# Altium project Hydrophone2012.PrjPCB
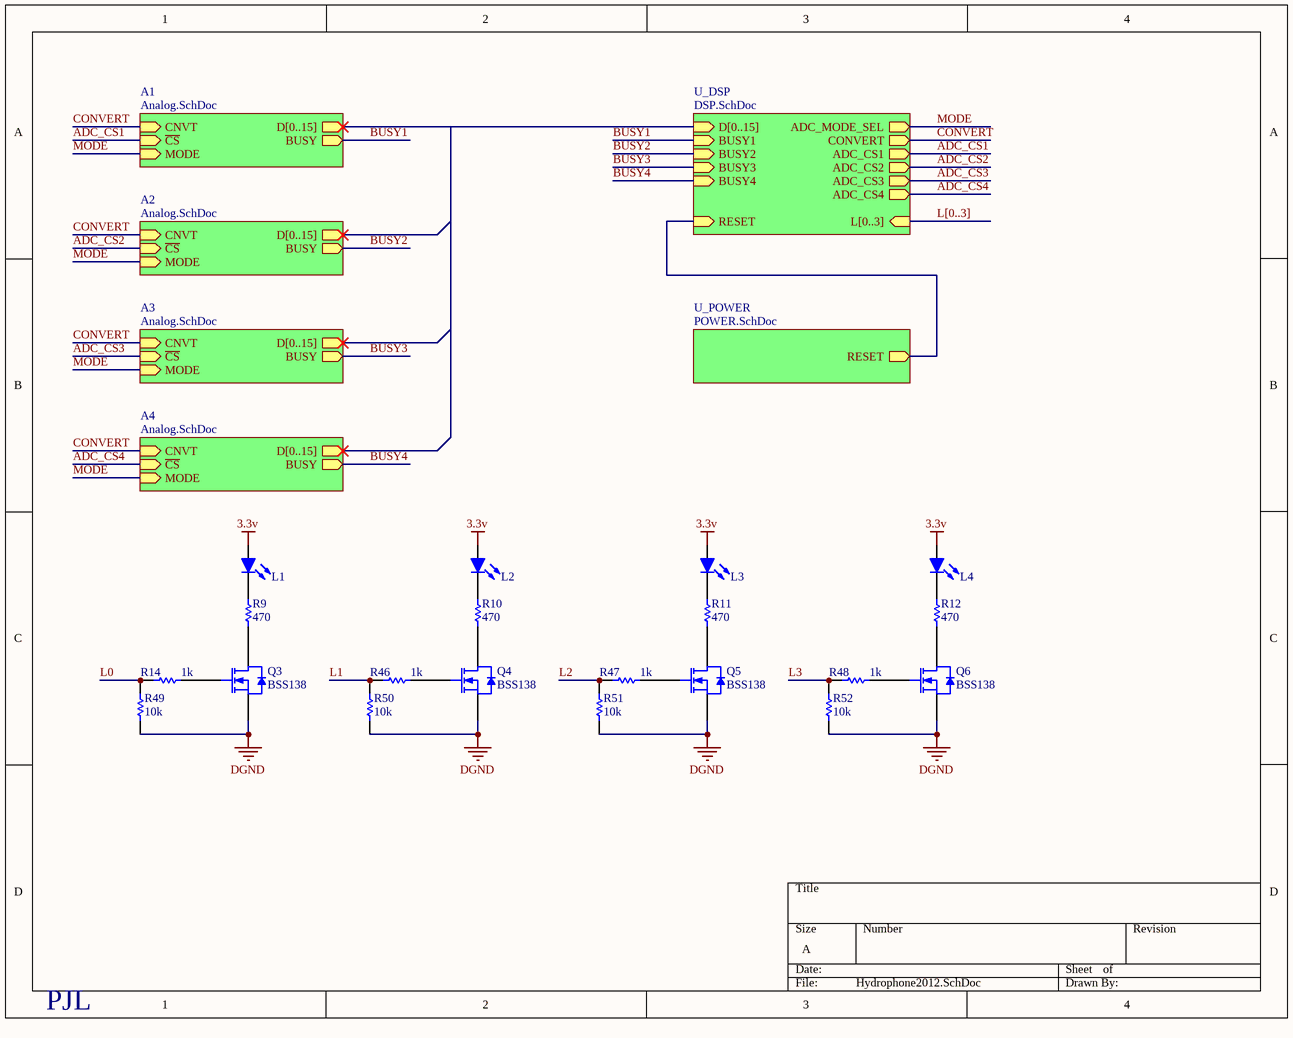
[diagram p0: Hydrophone2012.SchDoc]
5 sheets, 354 parts. Net scope: hierarchical (ports join the sheet entries above them; power ports are global).
Board file: Hydrophone2012.PcbDoc
Sheets:
  Hydrophone2012.SchDoc
    U_POWER = POWER.SchDoc
    A1 = Analog.SchDoc
    A2 = Analog.SchDoc
    A3 = Analog.SchDoc
    A4 = Analog.SchDoc
    U_DSP = DSP.SchDoc
      U_USB = USB.SchDoc

## Sheet Hydrophone2012.SchDoc
size A

### Parts
L1  LED-RED  [LED0805-RED]  (value not drawn)
L2  LED-RED  [LED0805-RED]  (value not drawn)
L3  LED-RED  [LED0805-RED]  (value not drawn)
L4  LED-RED  [LED0805-RED]  (value not drawn)
LOGO1  UF LOGO  [UF LOGO-1000]  (value not drawn)
LOGO2  SubjuGator Logo  [SubjuGator-1200]  (value not drawn)
MIL  MIL LOGO  [MIL LOGO - 600P]  (value not drawn)
Q3  BSS138  [SOT95P237X111-3L]
Q4  BSS138  [SOT95P237X111-3L]
Q5  BSS138  [SOT95P237X111-3L]
Q6  BSS138  [SOT95P237X111-3L]
R9  470  [RESC1608XN]
R10  470  [RESC1608XN]
R11  470  [RESC1608XN]
R12  470  [RESC1608XN]
R14  1k  [RESC1608XL]
R46  1k  [RESC1608XL]
R47  1k  [RESC1608XL]
R48  1k  [RESC1608XL]
R49  10k  [RESC1608XL]
R50  10k  [RESC1608XL]
R51  10k  [RESC1608XL]
R52  10k  [RESC1608XL]

### Sub-sheets
A1 = Analog.SchDoc: D[0..15] (out, harness Harness), CNVT (in), BUSY (out), ~{CS} (in), MODE (in)
A2 = Analog.SchDoc: D[0..15] (out), CNVT (in), BUSY (out), ~{CS} (in), MODE (in)
A3 = Analog.SchDoc: D[0..15] (out), CNVT (in), BUSY (out), ~{CS} (in), MODE (in)
A4 = Analog.SchDoc: D[0..15] (out), CNVT (in), BUSY (out), ~{CS} (in), MODE (in)
U_DSP = DSP.SchDoc: ADC_MODE_SEL (out), D[0..15] (in), CONVERT (out), ADC_CS1 (out), ADC_CS2 (out), ADC_CS3 (out), ADC_CS4 (out), BUSY1 (in), BUSY2 (in), BUSY3 (in), BUSY4 (in), RESET (in), L[0..3] (in)
U_POWER = POWER.SchDoc: RESET (out)

### Nets
3.3v: L1.2(A) L2.2(A) L3.2(A) L4.2(A)
DGND: Q3.2(S) Q4.2(S) Q5.2(S) Q6.2(S) R49.2 R50.2 R51.2 R52.2
ADC_CS1: sheet A1/~{CS}, sheet U_DSP/ADC_CS1
ADC_CS2: sheet A2/~{CS}, sheet U_DSP/ADC_CS2
ADC_CS3: sheet A3/~{CS}, sheet U_DSP/ADC_CS3
ADC_CS4: sheet A4/~{CS}, sheet U_DSP/ADC_CS4
BUSY1: sheet A1/BUSY, sheet U_DSP/BUSY1
BUSY2: sheet A2/BUSY, sheet U_DSP/BUSY2
BUSY3: sheet A3/BUSY, sheet U_DSP/BUSY3
BUSY4: sheet A4/BUSY, sheet U_DSP/BUSY4
CONVERT: sheet A1/CNVT, sheet A2/CNVT, sheet A3/CNVT, sheet A4/CNVT, sheet U_DSP/CONVERT
L0: R14.1 R49.1
L1: R46.1 R50.1
L2: R47.1 R51.1
L3: R48.1 R52.1
MODE: sheet A1/MODE, sheet A2/MODE, sheet A3/MODE, sheet A4/MODE, sheet U_DSP/ADC_MODE_SEL
NetL1_1: L1.1(K) R9.2
NetL2_1: L2.1(K) R10.2
NetL3_1: L3.1(K) R11.2
NetL4_1: L4.1(K) R12.2
NetNC1_1: sheet U_POWER/RESET, sheet U_DSP/RESET
NetQ3_1: Q3.1(G) R14.2
NetQ3_3: Q3.3(D) R9.1
NetQ4_1: Q4.1(G) R46.2
NetQ4_3: Q4.3(D) R10.1
NetQ5_1: Q5.1(G) R47.2
NetQ5_3: Q5.3(D) R11.1
NetQ6_1: Q6.1(G) R48.2
NetQ6_3: Q6.3(D) R12.1

### Buses and harness runs
bus L[0..3] = sheet U_DSP/L[0..3]
bus sheet A2/D[0..15] = sheet A3/D[0..15] = sheet A4/D[0..15] = sheet U_DSP/D[0..15]

### Notes on the sheet
- (near LOGO1) PJL

### Library data of the parts
L1-L4 = LED-RED: Light Emitting Diode - RED; Manufacturer Part Number: LTST-C170CKT; Manufacturer: Lite-On Inc; Millicandela Rating: 10mcd; Viewing Angle: 130°; Voltage - Forward (Vf) Typ: 1.8V; Current - Test: 10mA; Package / Case: 0805 (2012 Metric); Color: Red; Supplier Part Number: 160-1176-2-ND; Supplier: Digi-Key
Q3-Q6 = BSS138: 200ma N-Channel Mosfet; Manufacturer Part Number: BSS138LT1G; Manufacturer: ON Semiconductor; Supplier Part Number: BSS138LT1GOSCT-ND; Supplier: Digi-Key; Package / Case: TO-236-3, SC-59, SOT-23-3
R9-R12 = RES-CHIP: RES 470 OHM .25W 5% 0603 SMD; Manufacturer: Vishay Dale; Manufacturer Part Number: CRCW0603470RJNEAHP; Power (Watts): 0.25W, 1/4W; Supplier Part Number: 541-470SACT-ND; Supplier: Digi-Key; Resistance (Ohms): 470; Package / Case: 0603 (1608 Metric); Tolerance: ±5%
R14 R46-R48 = RES-CHIP: Resistor Chip; Manufacturer: Yageo; Manufacturer Part Number: RC0603JR-071KL; Tolerance: ±5%; Power (Watts): 0.1W, 1/10W; Supplier Part Number: 311-1.0KGRCT-ND; Supplier: Digi-Key; Package / Case: 0603 (1608 Metric); Resistance (Ohms): 1k
R49-R52 = RES-CHIP: Resistor Chip; Manufacturer: Yageo; Manufacturer Part Number: RC0603JR-0710KL; Tolerance: ±5%; Power (Watts): 0.1W, 1/10W; Supplier Part Number: 311-10KGRCT-ND; Supplier: Digi-Key; Package / Case: 0603 (1608 Metric); Resistance (Ohms): 10k

## Sheet POWER.SchDoc
size B
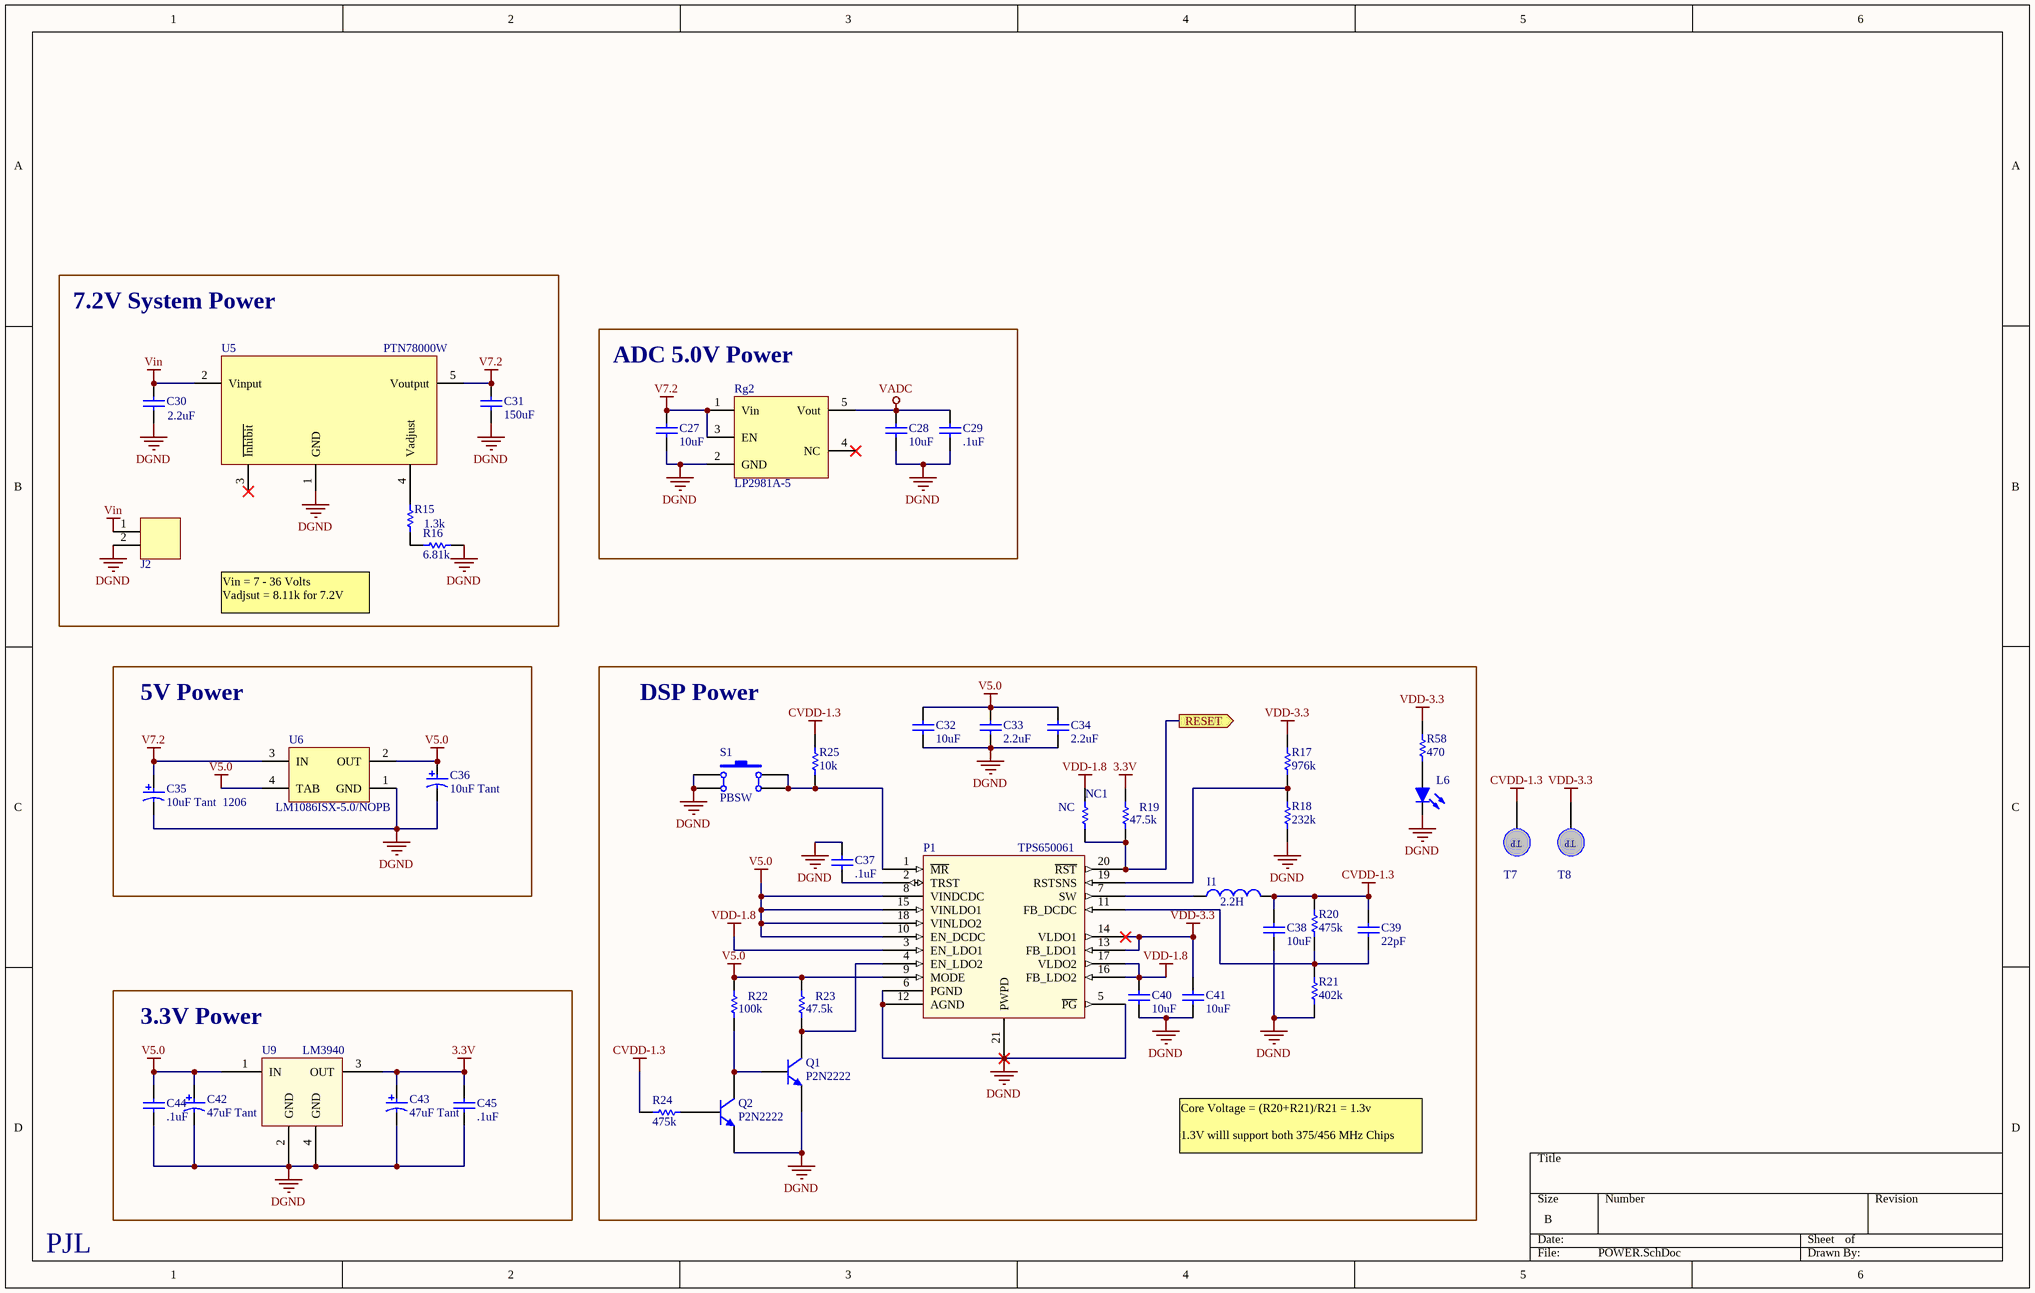
[diagram p1: POWER.SchDoc]

### Parts
C27  10uF  [CAPC2012XL]
C28  10uF  [CAPC2012XL]
C29  .1uF  [CAPC1608XN]
C30  2.2uF  [CAPC2012XL]
C31  150uF  [CAPPR2.5-6.3x11]
C32  10uF  [CAPC2012XL]
C33  2.2uF  [CAPC1608XN]
C34  2.2uF  [CAPC1608XN]
C35  10uF Tant  1206  [CAPMP3216XN]
C36  10uF Tant  [CAPMP2012XL]
C37  .1uF  [CAPC1608XN]
C38  10uF  [CAPC2012XL]
C39  22pF  [CAPC1608XN]
C40  10uF  [CAPC2012XL]
C41  10uF  [CAPC2012XL]
C42  47uF Tant  [CAPMP2012XL]
C43  47uF Tant  [CAPMP2012XL]
C44  .1uF  [CAPC1608XN]
C45  .1uF  [CAPC1608XN]
I1  2.2H  [LPS3015]
J2  2-pin Horz Sherlock  [MOLEX-HDR-1X2-SHERLOCK-HORZ]  (value not drawn)
L6  LED-GREEN  [LED0805-GREEN]  (value not drawn)
NC1  NC  [RESC1608XN]
P1  TPS650061  [QFN4-20N]
Q1  P2N2222  [TO-92A]
Q2  P2N2222  [TO-92A]
R15  1.3k  [RESC1608XL]
R16  6.81k  [RESC1608XL]
R17  976k  [RESC1608XL]
R18  232k  [RESC1608XL]
R19  47.5k  [RESC1608XN]
R20  475k  [RESC1608XL]
R21  402k  [RESC1608XL]
R22  100k  [RESC1608XL]
R23  47.5k  [RESC1608XN]
R24  475k  [RESC1608XL]
R25  10k  [RESC1608XL]
R58  470  [RESC1608XN]
Rg2  LP2981A-5  [TI-SOT-23_5N]
S1  PBSW  [PBSW]
T7  TEST MINI  [TEST-POINT - 5015]  (value not drawn)
T8  TEST MINI  [TEST-POINT - 5015]  (value not drawn)
U5  PTN78000W  [TI-EUS - 3d]
U6  LM1086ISX-5.0/NOPB  [TO263]
U9  LM3940  [SOT230P700X155-4N]

### Blocks framed on the sheet
7.2V System Power: C30 C31 J2 R15 R16 U5
ADC 5.0V Power: C27-C29 Rg2
5V Power: C35 C36 U6
DSP Power: C32-C34 C37-C41 I1 L6 NC1 P1 Q1 Q2 R17-R25 R58 S1
3.3V Power: C42-C45 U9

### Ports
RESET (out)

### Nets
3.3v: C43.1 C45.2 R19.2 U9.3(OUT)
CVDD-1.3: C38.2 C39.2 I1.2 R20.2 R24.2 R25.2 T7.1
DGND: C27.1 C28.1 C29.1 C30.1 C31.2 C32.1 C33.1 C34.1 C35.2 C36.2 C37.2 C38.1 C40.1 C41.1 C42.2 C43.2 C44.1 C45.1 J2.2 L6.1(K) P1.5(~{PG}) P1.6(PGND) P1.12(AGND) P1.21(PWPD) Q1.3(E) Q2.3(E) R16.1 R18.2 R21.2 Rg2.2(GND) S1.1(A) S1.2(A') U5.1(GND) U6.1(GND) U9.2(GND) U9.4(GND)
V5.0: C32.2 C33.2 C34.2 C36.1 C42.1 C44.2 P1.8(VINDCDC) P1.9(MODE) P1.10(EN_DCDC) P1.15(VINLDO1) P1.18(VINLDO2) R22.2 R23.2 U6.2(OUT) U6.4(TAB) U9.1(IN)
V7.2: C27.2 C31.1 C35.1 Rg2.1(Vin) Rg2.3(EN) U5.5(Voutput) U6.3(IN)
VADC: C28.2 C29.2 Rg2.5(Vout)
VDD-1.8: C40.2 NC1.2 P1.3(EN_LDO1) P1.16(FB_LDO2) P1.17(VLDO2)
VDD-3.3: C41.2 P1.13(FB_LDO1) P1.14(VLDO1) R17.1 R58.2 T8.1
Vin: C30.2 J2.1 U5.2(Vinput)
NetC37_1: C37.1 P1.2(TRST)
NetC39_1: C39.1 P1.11(FB_DCDC) R20.1 R21.1
NetI1_1: I1.1 P1.7(SW)
NetL6_2: L6.2(A) R58.1
NetNC1_1: NC1.1 P1.20(~{RST}) R19.1 ; port RESET
NetP1_1: P1.1(~{MR}) R25.1 S1.3(B) S1.4(B')
NetP1_4: P1.4(EN_LDO2) Q1.1(C) R23.1
NetP1_19: P1.19(RSTSNS) R17.2 R18.1
NetQ1_2: Q1.2(B) Q2.1(C) R22.1
NetQ2_2: Q2.2(B) R24.1
NetR15_1: R15.1 U5.4(Vadjust)
NetR15_2: R15.2 R16.2

Not connected (* = marked no-connect by the designer): Rg2 4(NC)*; U5 3(~{Inhibit})*

### Notes on the sheet
- Vin = 7 - 36 Volts
  Vadjsut = 8.11k for 7.2V
- Core Voltage = (R20+R21)/R21 = 1.3v
  1.3V willl support both 375/456 MHz Chips
- PJL
- (in symbol TEST-POINT) TP

### Library data of the parts
C27 C28 C32 C38 C40 C41 = CAP-CERAMIC-NP: CAP CER 10UF 10V 10% X7R 0805; Manufacturer: Murata Electronics North America; Manufacturer Part Number: GRM21BR71A106KE51L; Capacitance: 10µF; Tolerance: ±10%; Operating Temperature: -55°C ~ 125°C; Supplier Part Number: 490-3905-1-ND; Supplier: Digi-Key; Voltage - Rated: 10V; Package / Case: 0805 (2012 Metric)
C29 C44 C45 = CAP-CERAMIC-NP: CAP CER 0.1UF 10V 20% X7R 0603; Manufacturer Part Number: CX0603MRX7R6BB104; Manufacturer: Yageo; Capacitance: 0.1µF; Applications: Bypass, Decoupling; Operating Temperature: -55°C ~ 125°C; Tolerance: ±20%; Package / Case: 0603 (1608 Metric); Voltage - Rated: 10V; Temperature Coefficient: X7R; Supplier Part Number: 311-1237-1-ND; Supplier: Digi-Key
C30 = Capacitor: Non Polarized Capacitor 2.2uF; Manufacturer: TDK Corporation; Manufacturer Part Number: C2012X5R1H225K; Value: 2.2uF; Supplier: DigiKey; Supplier Part Number: 445-5976-1-ND
C31 = Capacitor: CAP ALUM 150UF 25V 20% RADIAL; Manufacturer: Panasonic Electronic Components; Manufacturer Part Number: EEU-FR1E151; Capacitance: 150µF; Supplier Part Number: P14414-ND; Supplier: Digi-Key; Tolerance: ±20%; Package / Case: Radial, Can; Lead Spacing: 0.098" (2.50mm); Height - Seated (Max): 0.441" (11.20mm); Size / Dimension: 0.248" Dia (6.30mm); Voltage Rating: 25V
C33 C34 = CAP-CERAMIC-NP: CAP CER 2.2UF 10V 10% X5R 0603; Manufacturer: Murata Electronics North America; Manufacturer Part Number: GRM188R61A225KE34D; Capacitance: 2.2µF; Tolerance: ±10%; Package / Case: 0603 (1608 Metric); Voltage - Rated: 10V; Temperature Coefficient: X5R; Supplier: Digi-Key; Supplier Part Number: 490-1545-1-ND
C35 = CAP-TANT: Capacitor, Tantalum, Polarized; Manufacturer: Vishay Sprague; Manufacturer Size Code: A; Manufacturer Part Number: 293D106X9016A2TE3; ESR (Equivalent Series Resistance): 3 Ohm; Tolerance: ±10%; Capacitance: 10µF; Voltage - Rated: 16V; Description: CAP TANT 10UF 16V 10% 1206; Supplier: Digi-Key; Supplier Part Number: 718-1123-2-ND; Package / Case: 1206 (3216 Metric)
C36 = CAP-TANT: Capacitor, Tantalum, Polarized; Manufacturer: AVX Corporation; Manufacturer Part Number: TAJP106M010RNJ; Voltage - Rated: 10V; Capacitance: 10µF; Tolerance: ±20%; Description: CAP TANT 10UF 10V 20% 0805; Supplier: Digi-Key; Package / Case: 0805 (2012 Metric); Supplier Part Number: 478-3281-1-ND
C37 = CAP-CERAMIC-NP: CAP CER 0.1UF 16V 10% X7R 0603; Manufacturer Part Number: GRM188R71C104KA01D; Manufacturer: Murata Electronics North America; Capacitance: 0.1µF; Tolerance: ±10%; Package / Case: 0603 (1608 Metric); Supplier Part Number: 490-1532-1-ND; Supplier: Digi-Key; Voltage - Rated: 16V
C39 = CAP-CERAMIC-NP: CAP CER 22PF 50V 5% NP0 0603; Manufacturer: Murata Electronics North America; Manufacturer Part Number: GRM1885C1H220JA01D; Package / Case: 0603 (1608 Metric); Capacitance: 22pF; Tolerance: ±5%; Voltage - Rated: 50V; Supplier Part Number: 490-1411-1-ND; Supplier: Digi-Key
C42 C43 = CAP-TANT: Capacitor, Tantalum, Polarized; Manufacturer Part Number: TLJR476M010R3200; Manufacturer: AVX Corporation; Description: CAP TANT 47UF 10V 20% 0805; Voltage - Rated: 10V; Tolerance: ±20%; Capacitance: 47µF; Supplier: Digi-Key; Supplier Part Number: 478-5990-1-ND; Package / Case: 0805 (2012 Metric); Features: General Purpose
I1 = VLC5045: Manufacturer: Coilcraft; Manufacturer Part Number: LPS3015-222ML
J2 = MOLEX-HDR-1x2-SHERLOCK_RA: Header, Molex, 2mm Pitch Sherlock Header, Single Row, Horizontal, 2 Circuits, Length 3.3mm,  0353630260; Manufacturer: Molex Inc; Manufacturer Part Number: 0353630260; Supplier Part Number: WM18931-ND; Supplier: Digi-Key
L6 = LED-GREEN: Light Emitting Diode - GREEN; Manufacturer Part Number: LTST-C171GKT; Manufacturer: Lite-On Inc; Description: LED GREEN CLEAR THIN 0805 SMD; Viewing Angle: 130°; Millicandela Rating: 12mcd; Current - Test: 20mA; Voltage - Forward (Vf) Typ: 2.1V; Supplier Part Number: 160-1423-1-ND; Supplier: Digi-Key; Package / Case: 0805 (2012 Metric); Color: Green
NC1 = RES-CHIP: Resistor Chip
P1 = TPS650061: IC CONV STP-DWN 2.25MHZ DL 20QFN; Manufacturer: Texas Instruments; Manufacturer Part Number: TPS650061RUKT; Voltage - Supply: 2.3 V ~ 6 V; Operating Temperature: -40°C ~ 85°C; Package / Case: 20-WFQFN Exposed Pad; Supplier: Digi-Key; Supplier Part Number: 296-25358-1-ND
Q1 Q2 = P2N2222: TRANS GP SS NPN LP 40V TO92; Manufacturer Part Number: P2N2222AG; Manufacturer: ON Semiconductor; Transistor Type: NPN; Voltage - Collector Emitter Breakdown (Max): 40V; Supplier: Digi-Key; Package / Case: TO-226-3, TO-92-3 (TO-226AA); Supplier Part Number: P2N2222AGOS-ND
R15 = Resistor: 1.3k Ohm Resistor; Manufacturer Part Number: RT0603DRD071K3L; Manufacturer: Yageo; Tolerance: ±0.5%; Power (Watts): 0.1W, 1/10W; Description: RES 1.3K OHM 1/10W .5% 0603 SMD; Resistance (Ohms): 1.3k; Supplier Part Number: 311-1.3KDCT-ND; Package / Case: 0603 (1608 Metric); Supplier: Digi-Key
R16 = Resistor: Resistor 6.81k; Manufacturer: Yageo; Manufacturer Part Number: RT0603DRD076K81L; Power (Watts): 0.1W, 1/10W; Tolerance: ±0.5%; Description: RES 6.81K OHM 1/10W .5% 0603 SMD; Supplier Part Number: 311-6.81KDCT-ND; Resistance (Ohms): 6.81k; Supplier: Digi-Key; Package / Case: 0603 (1608 Metric)
R17 = RES-CHIP: Resistor Chip; Manufacturer Part Number: RC0603FR-07976KL; Manufacturer: Yageo; Power (Watts): 0.1W, 1/10W; Tolerance: ±1%; Description: RES 976K OHM 1/10W 1% 0603 SMD; Resistance (Ohms): 976k; Package / Case: 0603 (1608 Metric); Supplier Part Number: 311-976KHRCT-ND; Supplier: Digi-Key
R18 = RES-CHIP: Resistor Chip; Manufacturer Part Number: CRCW0603232KFKEA; Manufacturer: Vishay Dale; Tolerance: ±1%; Power (Watts): 0.1W, 1/10W; Description: RES 232K OHM 1/10W 1% 0603 SMD; Package / Case: 0603 (1608 Metric); Resistance (Ohms): 232k; Supplier Part Number: 541-232KHTR-ND; Supplier: Digi-Key
R19 R23 = RES-CHIP: Resistor Chip; Manufacturer: TE Connectivity; Manufacturer Part Number: 2-1879338-5; Description: RES 47.5K OHM 1/16W 1% 0603; Tolerance: ±1%; Power (Watts): 0.063W, 1/16W; Supplier Part Number: A102279CT-ND; Supplier: Digi-Key; Package / Case: 0603 (1608 Metric); Resistance (Ohms): 47.5k
R20 R24 = RES-CHIP: Resistor Chip; Manufacturer: Yageo; Manufacturer Part Number: RC0603FR-07475KL; Tolerance: ±1%; Power (Watts): 0.1W, 1/10W; Description: RES 475K OHM 1/10W 1% 0603 SMD; Package / Case: 0603 (1608 Metric); Resistance (Ohms): 475k; Supplier: Digi-Key; Supplier Part Number: 311-475KHRTR-ND
R21 = RES-CHIP: RES 402K OHM 1/10W 1% 0603 SMD; Manufacturer: Yageo; Manufacturer Part Number: RC0603FR-07402KL; Power (Watts): 0.1W, 1/10W; Supplier: Digi-Key; Package / Case: 0603 (1608 Metric); Tolerance: ±1%; Resistance (Ohms): 402k; Supplier Part Number: 311-402KHRCT-ND
R22 = RES-CHIP: RES 100K OHM 1/10W 1% 0603 SMD; Manufacturer Part Number: RC0603FR-07100KL; Manufacturer: Yageo; Power (Watts): 0.1W, 1/10W; Supplier Part Number: 311-100KHRTR-ND; Supplier: Digi-Key; Resistance (Ohms): 100k; Tolerance: ±1%; Package / Case: 0603 (1608 Metric)
R25 = RES-CHIP: Resistor Chip; Manufacturer: Yageo; Manufacturer Part Number: RC0603JR-0710KL; Description: RES 10K OHM 1/10W 5% 0603 SMD; Tolerance: ±5%; Power (Watts): 0.1W, 1/10W; Supplier Part Number: 311-10KGRCT-ND; Supplier: Digi-Key; Package / Case: 0603 (1608 Metric); Resistance (Ohms): 10k
R58 = RES-CHIP: as R9 on sheet Hydrophone2012; Supplier Part Number: 541-470SACT-ND; Supplier: Digi-Key; Resistance (Ohms): 470; Package / Case: 0603 (1608 Metric); Tolerance: ±5%
Rg2 = LP2981A: 100mA 5v LDO - 0.75% accuracy; Manufacturer: Texas Instruments; Manufacturer Part Number: LP2981A-50DBVT; Description: IC REG LDO 5V .1A SOT23-5; Voltage - Input: Up to 16V; Current - Output: 100mA (Max); Voltage - Dropout (Typical): 0.2V @ 100mA; Supplier Part Number: 296-32146-1-ND; Supplier: Digi-Key; Operating Temperature: -40°C ~ 125°C; Supplier Device Package: SOT-23-5; Voltage - Output: 5V
S1 = SW-PB: Push Button Switch; Manufacturer: Panasonic Electronic Components; Manufacturer Part Number: EVQ-9P105M; Description: SWITCH TACTILE SPST-NO 0.05A 12V; Outline: 6.10mm x 6.00mm; Actuator Orientation: Top Actuated; Actuator Height off PCB, from Pins: 5.00mm; Published: 24-Mar-1999; LatestRevisionDate: 17-Jul-2002; LatestRevisionNote: Re-released for DXP Platform.; PackageReference: SPST-2; Publisher: Altium Limited; PackageDescription: Switch; 2 Leads; Supplier: Digi-Key; Supplier Part Number: P13586SCT-ND
T7 T8 = TEST-POINT: PC TEST POINT MINIATURE SMT; Manufacturer: Keystone Electronics; Manufacturer Part Number: 5015; Supplier: Digi-Key; Supplier Part Number: 5015KDKR-ND
U5 = PTN78000W: 1.5A, 7-36V Input, Variable Switching Voltage Regulator; Manufacturer Part Number: PTN78000WAH; Order Part Number: 296-20506-ND; Manufacturer: Texas Instruments; Description: REG SW 2.5-12.6V 1.5A HORZ T/H; Voltage - Input (Max): 36V; Voltage - Input (Min): 7V; Voltage - Output 1: 2.5 ~ 12.6 V; Efficiency: 91%; Supplier: Digi-Key; Current - Output (Max): 1.5A; Supplier Part Number: 296-20506-ND
U6 = LM1086ISX-5.0/NOPB: 1.5A Low Dropout Positive Regulators, 3-pin TO-263, Pb-Free; Manufacturer: National Semiconductor; Voltage - Dropout (Typical): 1.3V @ 1.5A; Voltage - Input: Up to 25V; Voltage - Output: 5V; Description: IC REG LDO 5V 1.5A TO-263; Manufacturer Part Number: LM1086ISX-5.0/NOPB; Current - Output: 1.5A; Supplier: Digi-Key; Package / Case: TO-263-4, D²Pak (3 Leads + Tab), TO-263AA; Supplier Device Package: TO-263-3; Supplier Part Number: LM1086IS-5.0-ND
U9 = LM3940: 3.3V Regulator from a 5V Supply; Manufacturer: National Semiconductor; Manufacturer Part Number: LM3940IMP-3.3/NOPB; Current - Output: 1A; Description: IC REG LDO 3.3V 1A SOT-223; Voltage - Input: Up to 7.5V; Voltage - Dropout (Typical): 0.5V @ 1A; Package / Case: TO-261-4, TO-261AA; Supplier Part Number: LM3940IMP-3.3CT-ND; Voltage - Output: 3.3V; Supplier: Digi-Key

## Sheet Analog.SchDoc
size B
Used 4 times, as channels A1, A2, A3, A4. Parts and nets are listed once, with the designators drawn on the sheet.
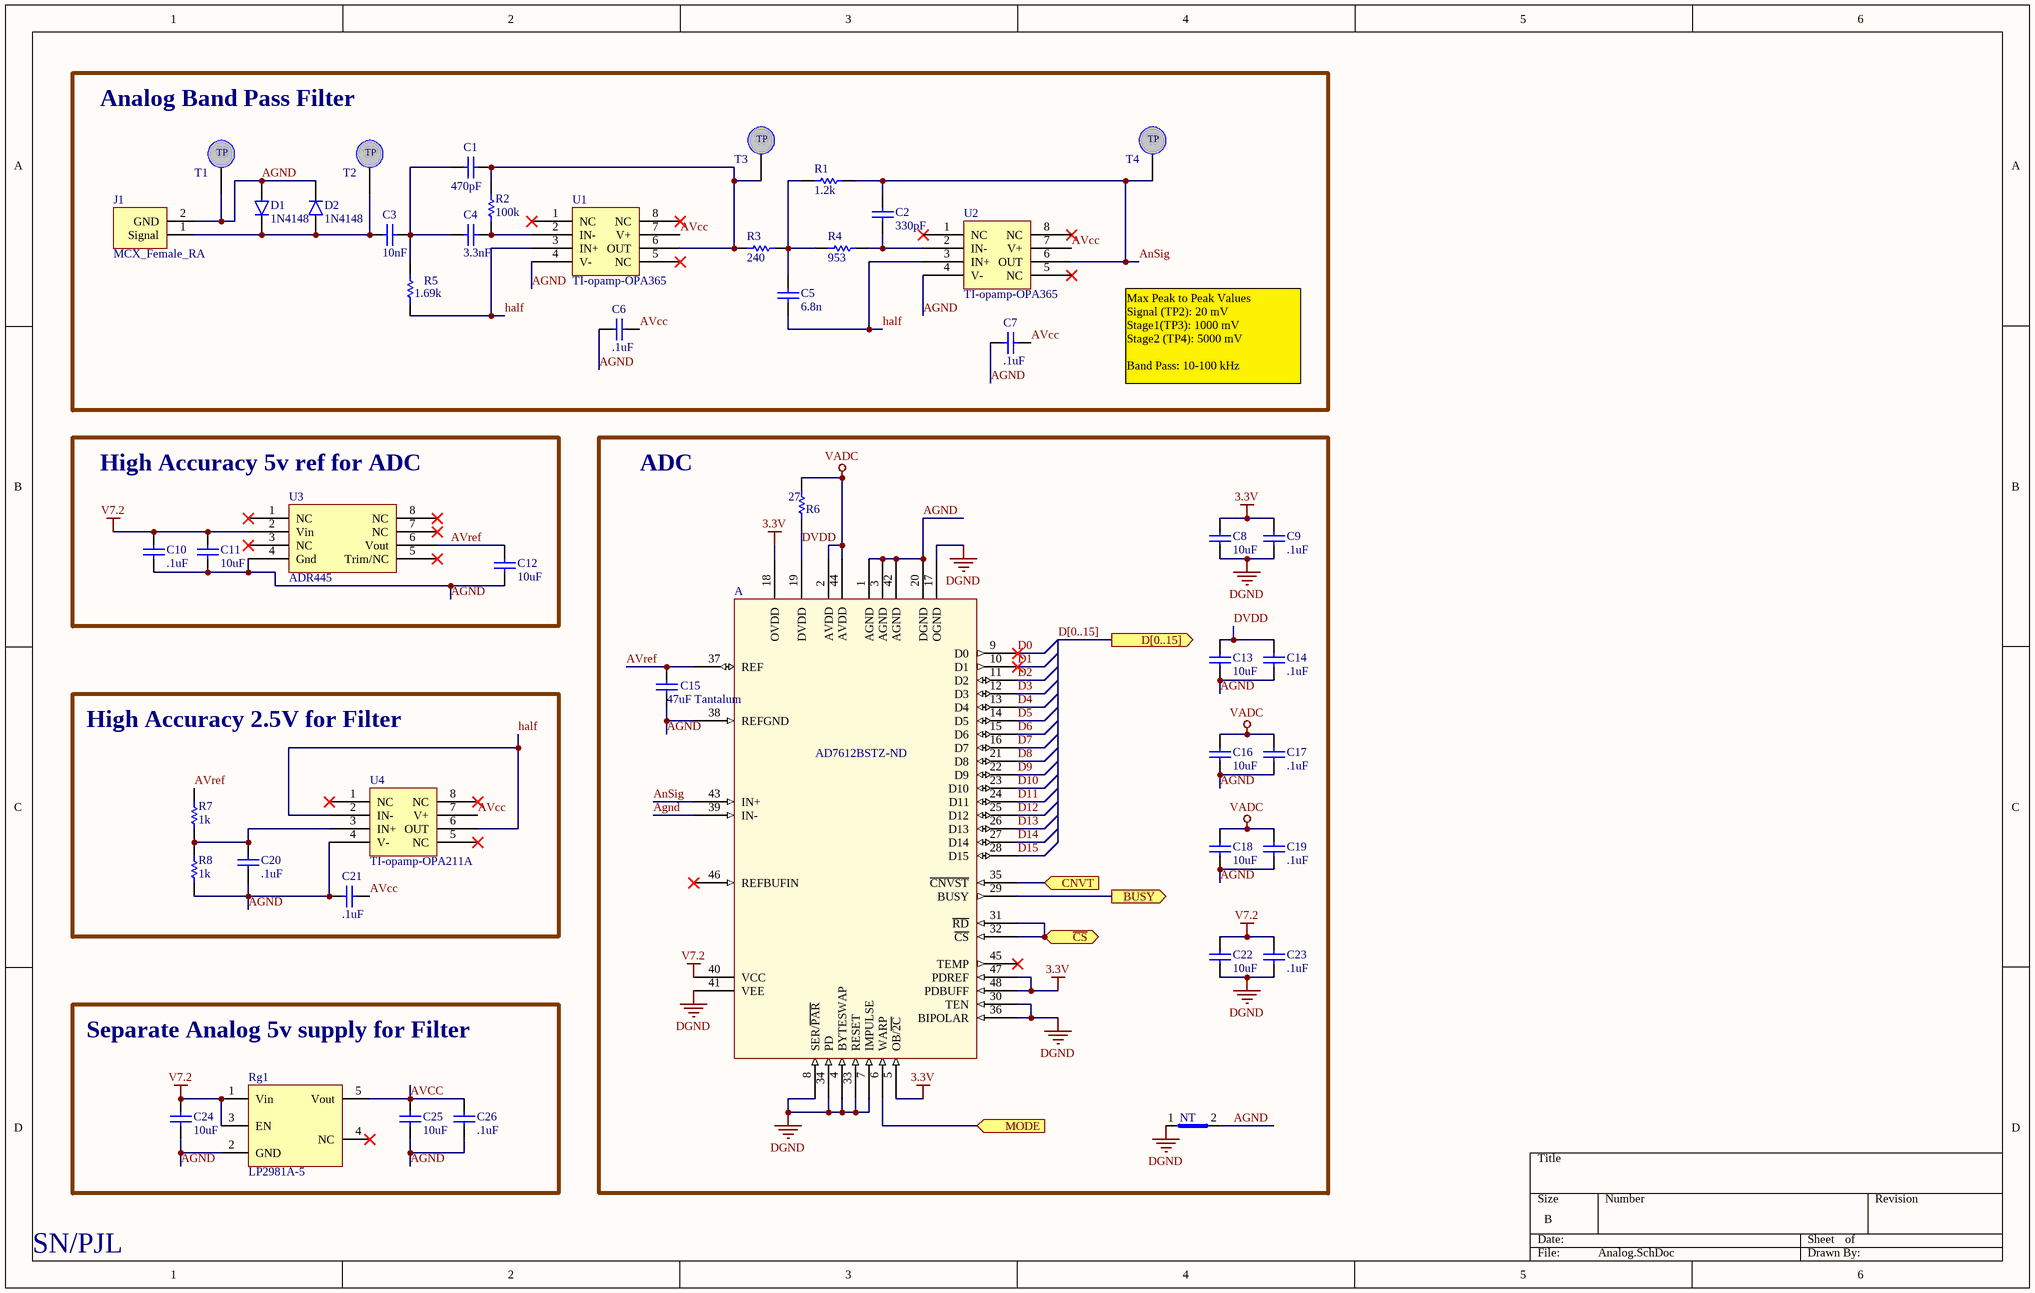
[diagram p2: Analog.SchDoc]

### Parts
A  Supplier Part Number: AD7612BSTZ-ND  [LQFP-48N - ADC]  (hidden comment: AD7612)
C1  470pF  [CAPC2012XN]
C2  330pF  [CAPC2012XN]
C3  10nF  [CAPC2012XN]
C4  3.3nF  [CAPC2012XN]
C5  6.8n  [CAPC2012XN]
C6  .1uF  [CAPC1608XN]
C7  .1uF  [CAPC1608XN]
C8  10uF  [CAPC2012XL]
C9  .1uF  [CAPC1608XN]
C10  .1uF  [CAPC1608XN]
C11  10uF  [CAPC2012XL]
C12  10uF  [CAPC2012XL]
C13  10uF  [CAPC2012XL]
C14  .1uF  [CAPC1608XN]
C15  47uF Tantalum  [CAPC2012XL]
C16  10uF  [CAPC2012XL]
C17  .1uF  [CAPC1608XN]
C18  10uF  [CAPC2012XL]
C19  .1uF  [CAPC1608XN]
C20  .1uF  [CAPC1608XN]
C21  .1uF  [CAPC1608XN]
C22  10uF  [CAPC2012XL]
C23  .1uF  [CAPC1608XN]
C24  10uF  [CAPC2012XL]
C25  10uF  [CAPC2012XL]
C26  .1uF  [CAPC1608XN]
D1  1N4148  [MCC-SOD123]
D2  1N4148  [MCC-SOD123]
J1  MCX_Female_RA  [MCX_Female]
NT  Net Tie SMT  [NetTie 35 mil]  (value not drawn)  (net tie, no BOM)
R1  1.2k  [RESC2012XN]
R2  100k  [RESC2012XN]
R3  240  [RESC2012XN]
R4  953  [RESC2012XN]
R5  1.69k  [RESC2012XN]
R6  27  [RESC2012XN]
R7  1k  [RESC2012XN]
R8  1k  [RESC2012XN]
Rg1  LP2981A-5  [TI-SOT-23_5N]
T1  TEST  [KEYSTONE-TEST-POINT]  (value not drawn)
T2  TEST  [KEYSTONE-TEST-POINT]  (value not drawn)
T3  TEST  [KEYSTONE-TEST-POINT]  (value not drawn)
T4  TEST  [KEYSTONE-TEST-POINT]  (value not drawn)
U1  TI-opamp-OPA365  [TI-SOIC1-8N]
U2  TI-opamp-OPA365  [TI-SOIC1-8N]
U3  ADR445  [TI-SOIC1-8N]
U4  TI-opamp-OPA211A  [TI-SOIC1-8N]

### Blocks framed on the sheet
Analog Band Pass Filter: C1-C7 D1 D2 J1 R1-R5 T1-T4 U1 U2
High Accuracy 5v ref for ADC: C10-C12 U3
ADC: A C8 C9 C13-C19 C22 C23 NT R6
High Accuracy 2.5V for Filter: C20 C21 R7 R8 U4
Separate Analog 5v supply for Filter: C24-C26 Rg1

### Ports
BUSY (out), CNVT (in), D[0..15] (out), MODE (in), ~{CS} (in)

### Nets
3.3V: A.5(OB/~{2C}) A.18(OVDD) A.47(PDREF) A.48(PDBUFF) C8.2 C9.2
DGND: A.4(BYTESWAP) A.7(IMPULSE) A.8(SER/~{PAR}) A.17(OGND) A.30(TEN) A.33(RESET) A.34(PD) A.36(BIPOLAR) A.41(VEE) C8.1 C9.1 C22.1 C23.1 NT.1(Net1)
V7.2: A.40(VCC) C10.1 C11.2 C22.2 C23.2 C24.2 Rg1.1(Vin) Rg1.3(EN) U3.2(Vin)
VADC: A.2(AVDD) A.44(AVDD) C16.2 C17.2 C18.2 C19.2 R6.2
Agnd: A.1(AGND) A.3(AGND) A.20(DGND) A.38(REFGND) A.39(IN-) A.42(AGND) C6.2 C7.1 C10.2 C11.1 C12.1 C13.1 C14.1 C15.1 C16.1 C17.1 C18.1 C19.1 C20.1 C21.2 C24.1 C25.1 C26.1 D1.1(Anode) D2.2(Cathode) J1.2(GND) NT.2(Net2) R8.2 Rg1.2(GND) T1.1 U1.4(V-) U2.4(V-) U3.4(Gnd) U4.4(V-)
AnSig: A.43(IN+) C2.1 R1.1 T4.1 U2.6(OUT)
AVcc: C6.1 C7.2 C21.1 C25.2 C26.2 Rg1.5(Vout) U1.7(V+) U2.7(V+) U4.7(V+)
AVref: A.37(REF) C12.2 C15.2 R7.1 U3.6(Vout)
BUSY: A.29(BUSY) ; port BUSY
~{CS}: A.31(~{RD}) A.32(~{CS}) ; port ~{CS}
CNVT: A.35(~{CNVST}) ; port CNVT
D0: A.9(D0)
D1: A.10(D1)
D2: A.11(D2)
D3: A.12(D3)
D4: A.13(D4)
D5: A.14(D5)
D6: A.15(D6)
D7: A.16(D7)
D8: A.21(D8)
D9: A.22(D9)
D10: A.23(D10)
D11: A.24(D11)
D12: A.25(D12)
D13: A.26(D13)
D14: A.27(D14)
D15: A.28(D15)
DVDD: A.19(DVDD) C13.2 C14.2 R6.1
half: C5.2 R5.1 U1.3(IN+) U2.3(IN+) U4.2(IN-) U4.6(OUT)
MODE: A.6(WARP) ; port MODE
NetC1_1: C1.1 C3.2 C4.1 R5.2
NetC1_2: C1.2 R2.1 R3.2 T3.1 U1.6(OUT)
NetC2_2: C2.2 R4.1 U2.2(IN-)
NetC3_1: C3.1 D1.2(Cathode) D2.1(Anode) J1.1(Signal) T2.1
NetC4_2: C4.2 R2.2 U1.2(IN-)
NetC5_1: C5.1 R1.2 R3.1 R4.2
NetC20_2: C20.2 R7.2 R8.1 U4.3(IN+)

Not connected (* = marked no-connect by the designer): A 45(TEMP)* 46(REFBUFIN)*; Rg1 4(NC)*; U1 1(NC)* 5(NC)* 8(NC)*; U2 1(NC)* 5(NC)* 8(NC)*; U3 1(NC)* 3(NC)* 5(Trim/NC)* 7(NC)* 8(NC)*; U4 1(NC)* 5(NC)* 8(NC)*

### Channels
A1: designators end in _A1; ports BUSY=BUSY1 CNVT=CONVERT MODE=MODE ~{CS}=ADC_CS1
A2: designators end in _A2; ports BUSY=BUSY2 CNVT=CONVERT MODE=MODE ~{CS}=ADC_CS2
A3: designators end in _A3; ports BUSY=BUSY3 CNVT=CONVERT MODE=MODE ~{CS}=ADC_CS3
A4: designators end in _A4; ports BUSY=BUSY4 CNVT=CONVERT MODE=MODE ~{CS}=ADC_CS4

### Buses and harness runs
bus D[0..15] = port D[0..15]

### Notes on the sheet
- Max Peak to Peak Values
  Signal (TP2): 20 mV
  Stage1(TP3): 1000 mV
  Stage2 (TP4): 5000 mV
  Band Pass: 10-100 kHz
- SN/PJL
- (in symbol TEST-POINT) TP

### Library data of the parts
A = AD7623: Manufacturer Part Number: AD7612BSTZ; Manufacturer: Analog Devices Inc; Data Interface: Serial, Parallel; Sampling Rate (Per Second): 750k; Number of Bits: 16; Description: IC ADC 16BIT 750KSPS SAR 48-LQFP; Package / Case: 48-LQFP; Supplier: Digi-Key
C1 = CAP-CERAMIC-NP: Capacitor, Ceramic, Chip, Non-Polarized; Manufacturer Part Number: 08051A471FAT2A; Manufacturer: AVX Corporation; Voltage - Rated: 100V; Tolerance: ±1%; Description: CAP CER 470PF 100V 1% NP0 0805; Capacitance: 470pF; Package / Case: 0805 (2012 Metric); Supplier Part Number: 478-5272-1-ND; Supplier: Digi-Key
C2 = CAP-CERAMIC-NP: Capacitor, Ceramic, Chip, Non-Polarized; Manufacturer: AVX Corporation; Manufacturer Part Number: 08055A331FAT2A; Description: CAP CER 330PF 50V 1% NP0 0805; Voltage - Rated: 50V; Tolerance: ±1%; Supplier: Digi-Key; Supplier Part Number: 478-6045-1-ND; Thickness (Max): 0.037" (0.94mm); Capacitance: 330pF; Package / Case: 0805 (2012 Metric)
C3 = CAP-CERAMIC-NP: Capacitor, Ceramic, Chip, Non-Polarized; Manufacturer Part Number: GRM2195C1H103JA01D; Manufacturer: Murata Electronics North America; Tolerance: ±5%; Voltage Rating: ? V; Capacitance: 10000pF; Voltage - Rated: 50V; Description: CAP CER 10000PF 50V 5% NP0 0805; Supplier: Digi-Key; Supplier Part Number: 490-1642-1-ND; Package / Case: 0805 (2012 Metric)
C4 = CAP-CERAMIC-NP: Capacitor, Ceramic, Chip, Non-Polarized; Manufacturer: Murata Electronics North America; Manufacturer Part Number: GRM2165C1H332JA01D; Voltage - Rated: 50V; Capacitance: 3300pF; Tolerance: ±5%; Description: CAP CER 3300PF 50V 5% NP0 0805; Package / Case: 0805 (2012 Metric); Supplier Part Number: 490-1632-1-ND; Supplier: Digi-Key
C5 = CAP-CERAMIC-NP: CAP CER 6800PF 50V 5% NP0 0805; Manufacturer: Murata Electronics North America; Manufacturer Part Number: GRM2195C1H682JA01D; Supplier: Digi-Key; Supplier Part Number: 490-1638-1-ND; Voltage - Rated: 50V; Capacitance: 6800pF; Tolerance: ±5%; Package / Case: 0805 (2012 Metric)
C6 C7 C9 C10 C14 C17 C19-C21 C23 C26 = CAP-CERAMIC-NP: as C29 on sheet POWER; Applications: Bypass, Decoupling; Operating Temperature: -55°C ~ 125°C; Tolerance: ±20%; Package / Case: 0603 (1608 Metric); Voltage - Rated: 10V; Temperature Coefficient: X7R; Supplier Part Number: 311-1237-1-ND; Supplier: Digi-Key
C8 C11-C13 C16 C18 C22 C24 C25 = CAP-CERAMIC-NP: as C27 on sheet POWER; Tolerance: ±10%; Operating Temperature: -55°C ~ 125°C; Supplier Part Number: 490-3905-1-ND; Supplier: Digi-Key; Voltage - Rated: 10V; Package / Case: 0805 (2012 Metric)
C15 = CAP-CERAMIC-NP: CAP TANT 47UF 10V 20% 0805; Manufacturer Part Number: TLJR476M010R3200; Manufacturer: AVX Corporation; ESR (Equivalent Series Resistance): 3.2 Ohm; Capacitance: 47µF; Package / Case: 0805 (2012 Metric); Supplier: Digi-Key; Supplier Part Number: 478-5990-1-ND; Tolerance: ±20%
D1 D2 = Diode - 1N4148W: DIODE SWITCH SS 75V 150MA SOD123; Manufacturer Part Number: 1N4148W-V-GS08; Manufacturer: Vishay Semiconductors; Speed: Small Signal =< 200mA (Io), Any Speed; Voltage - Forward (Vf) (Max) @ If: 1.2V @ 100mA; Diode Type: Standard; Supplier: Digi-Key; Package / Case: SOD-123; Supplier Device Package: SOD-123; Supplier Part Number: 1N4148W-V-GS08CT-ND; Current - Average Rectified (Io): 150mA; Voltage - DC Reverse (Vr) (Max): 75V
J1 = MCX_Female_RA: MCX female receptacle RA; Manufacturer Part Number: 1061023-1; Manufacturer: TE Connectivity; Frequency - Max: 6GHz; Impedance: 50 Ohm; Description: CONN JACK RCPT R/A 50 OHM NICKEL; Fastening Type: Snap-On; Mounting Type: Through Hole, Right Angle; Supplier Part Number: A98546-ND; Connector Style: MCX; Supplier: Digi-Key
NT = NetTie: Net-Tie, Surface Mount
R1 = RES-CHIP: RES 1.2K OHM .1% 1/4W 0805 SMD; Manufacturer Part Number: RG2012P-122-B-T5; Manufacturer: Susumu; Description: RES 1.2K OHM 1/8W .1% 0805 SMD; Power (Watts): 0.125W, 1/8W; Tolerance: ±0.1%; Supplier Part Number: RG20P1.2KBCT-ND; Resistance (Ohms): 1.2k; Supplier: Digi-Key; Package / Case: 0805 (2012 Metric)
R2 = RES-CHIP: RES PREC 100K OHM 250MW .1% 0805; Manufacturer Part Number: PFC-W0805LF-03-1003-B-1739; Manufacturer: TT Electronics/IRC; Temperature Coefficient: ±25ppm/°C; Tolerance: ±0.1%; Supplier Part Number: 989-1134-1-ND; Supplier: Digi-Key; Resistance (Ohms): 100k; Package / Case: 0805 (2012 Metric)
R3 = RES-CHIP: Resistor Chip; Manufacturer: Susumu; Manufacturer Part Number: RG2012P-241-B-T5; Tolerance: ±0.1%; Power (Watts): 0.125W, 1/8W; Description: RES 240 OHM 1/8W .1% 0805 SMD; Resistance (Ohms): 240; Package / Case: 0805 (2012 Metric); Supplier Part Number: RG20P240BCT-ND; Supplier: Digi-Key
R4 = RES-CHIP: Resistor Chip; Manufacturer: Panasonic Electronic Components; Manufacturer Part Number: ERA-6AEB9530V; Tolerance: ±0.1%; Description: RES 953 OHM 1/8W .1% 0805 SMD; Power (Watts): 0.125W, 1/8W; Supplier Part Number: P953DACT-ND; Resistance (Ohms): 953; Supplier: Digi-Key; Package / Case: 0805 (2012 Metric)
R5 = RES-CHIP: RES 1.69K OHM 1/8W .1% 0805 SMD; Manufacturer: Susumu; Manufacturer Part Number: RG2012P-1691-B-T5; Tolerance: ±0.1%; Power (Watts): 0.125W, 1/8W; Package / Case: 0805 (2012 Metric); Resistance (Ohms): 1.69k; Supplier Part Number: RG20P1.69KBCT-ND; Supplier: Digi-Key
R6 = Resistor: Manufacturer Part Number: ESR10EZPJ270; Manufacturer: Rohm Semiconductor; Power (Watts): 0.25W, 1/4W; Tolerance: ±5%; Description: RES 27 OHM 1/4W 5% 0805 SMD; Package / Case: 0805 (2012 Metric); Supplier Part Number: RHM27KCT-ND; Resistance (Ohms): 27; Supplier: Digi-Key
R7 R8 = RES-CHIP: Resistor Chip; Manufacturer: Susumu; Manufacturer Part Number: RGH2012-2E-P-102-B; Description: RES 1.0K OHM .1% 1/4W 0805 SMD; Power (Watts): 0.25W, 1/4W; Tolerance: ±0.1%; Supplier: Digi-Key; Supplier Part Number: RGH20P1.0KBCT-ND; Resistance (Ohms): 1k; Package / Case: 0805 (2012 Metric)
Rg1 = LP2981A: as Rg2 on sheet POWER; Supplier Part Number: 296-32146-1-ND; Supplier: Digi-Key; Operating Temperature: -40°C ~ 125°C; Supplier Device Package: SOT-23-5; Voltage - Output: 5V
T1 = TEST-POINT: Single pin, looped test point --- 0.063" (1.600mm) Hole Diameter; Manufacturer: Keystone Electronics; Manufacturer Part Number: 5006; Color: Black; Description: TEST POINT PC COMPACT .063"D BLK; Supplier Part Number: 5006K-ND; Supplier: Digi-Key
T2-T4 = TEST-POINT: Single pin, looped test point --- 0.063" (1.600mm) Hole Diameter; Manufacturer Part Number: 5006; Manufacturer: Keystone Electronics; Color: Black; Description: TEST POINT PC COMPACT .063"D BLK; Mounting Type: 0.063" (1.60mm) Hole Diameter; Supplier: Digi-Key; Supplier Part Number: 5006K-ND
U1 U2 = TI-opamp-OPA365: Manufacturer Part Number: OPA365AID; Manufacturer: Texas Instruments; Voltage - Supply, Single/Dual (±): 2.2 V ~ 5.5 V, ±1.1 V ~ 2.25 V; Current - Output / Channel: 65mA; Amplifier Type: General Purpose; Voltage - Input Offset: 100µV; Number of Circuits: 1; Gain Bandwidth Product: 50MHz; Output Type: Rail-to-Rail; Description: IC OPAMP GP R-R 50MHZ SGL 8SOIC; Supplier Part Number: 296-21235-5-ND; Supplier: Digi-Key; Package / Case: 8-SOIC (0.154", 3.90mm Width)
U3 = ADR445: Ultralow Noise, LDO XFET Voltage   References with Current Sink and Source; Manufacturer Part Number: ADR445BRZ; Manufacturer: Analog Devices Inc; Description: IC VREF SERIES PREC 5V 8-SOIC; Voltage - Output: 5V; Voltage - Input: 5.5 V ~ 18 V; Current - Output: 10mA; Tolerance: ±0.04%; Supplier Device Package: 8-SOIC N; Package / Case: 8-SOIC (0.154", 3.90mm Width); Supplier: Digi-Key; Supplier Part Number: ADR445BRZ-ND
U4 = TI-opamp-OPA211A: IC OPAMP GP R-R 80MHZ SGL 8SOIC; Manufacturer Part Number: OPA211AIDR; Manufacturer: Texas Instruments; Voltage - Supply, Single/Dual (±): 4.5 V ~ 36 V, ±2.25 V ~ 18 V; Output Type: Rail-to-Rail; Current - Output / Channel: 30mA; Supplier: Digi-Key; Supplier Device Package: 8-SOIC; Package / Case: 8-SOIC (0.154", 3.90mm Width); Supplier Part Number: 296-22634-1-ND; Gain Bandwidth Product: 80MHz

## Sheet DSP.SchDoc
size D
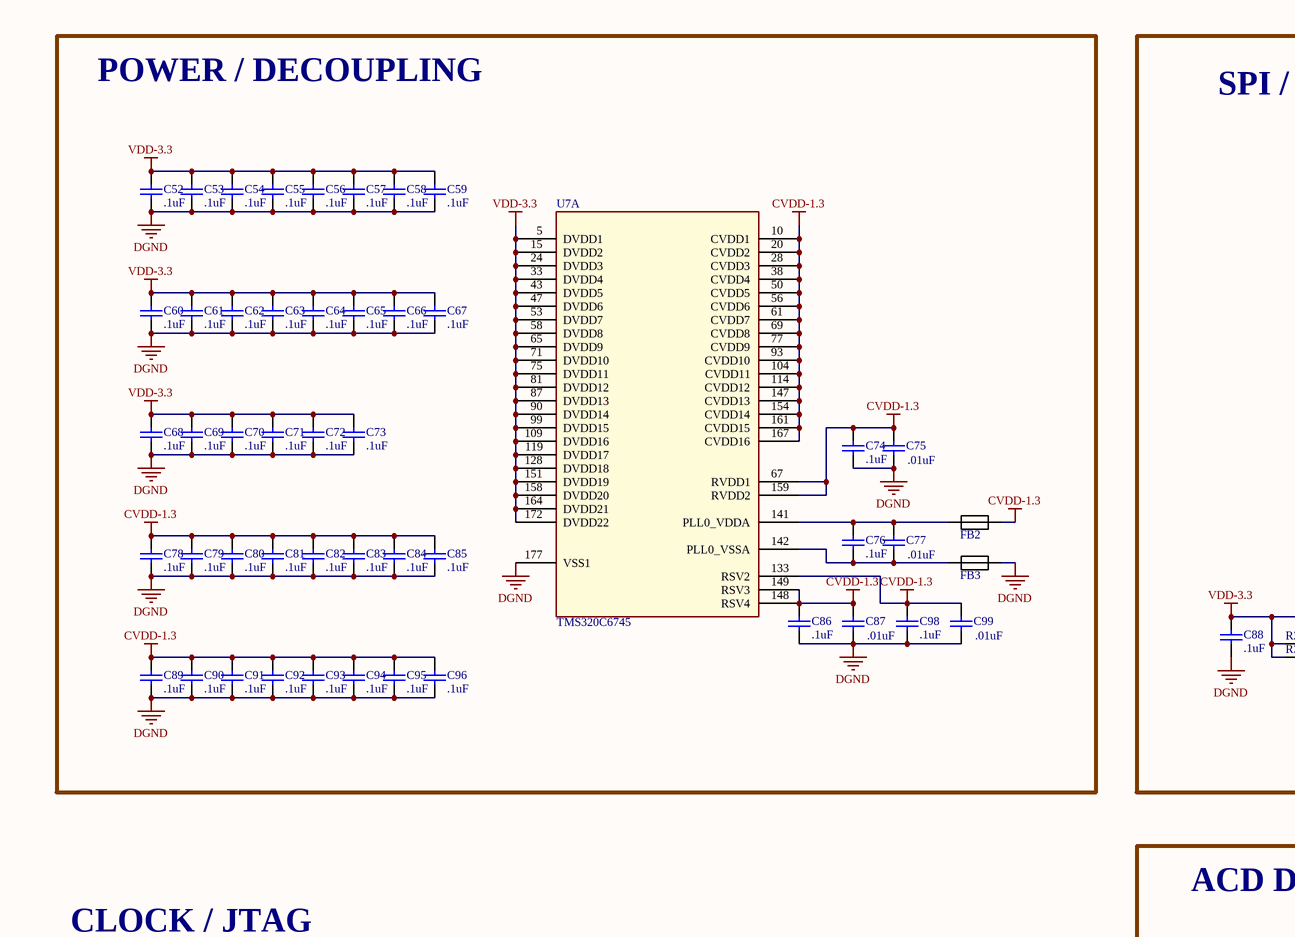
[diagram p3: DSP.SchDoc, top left]
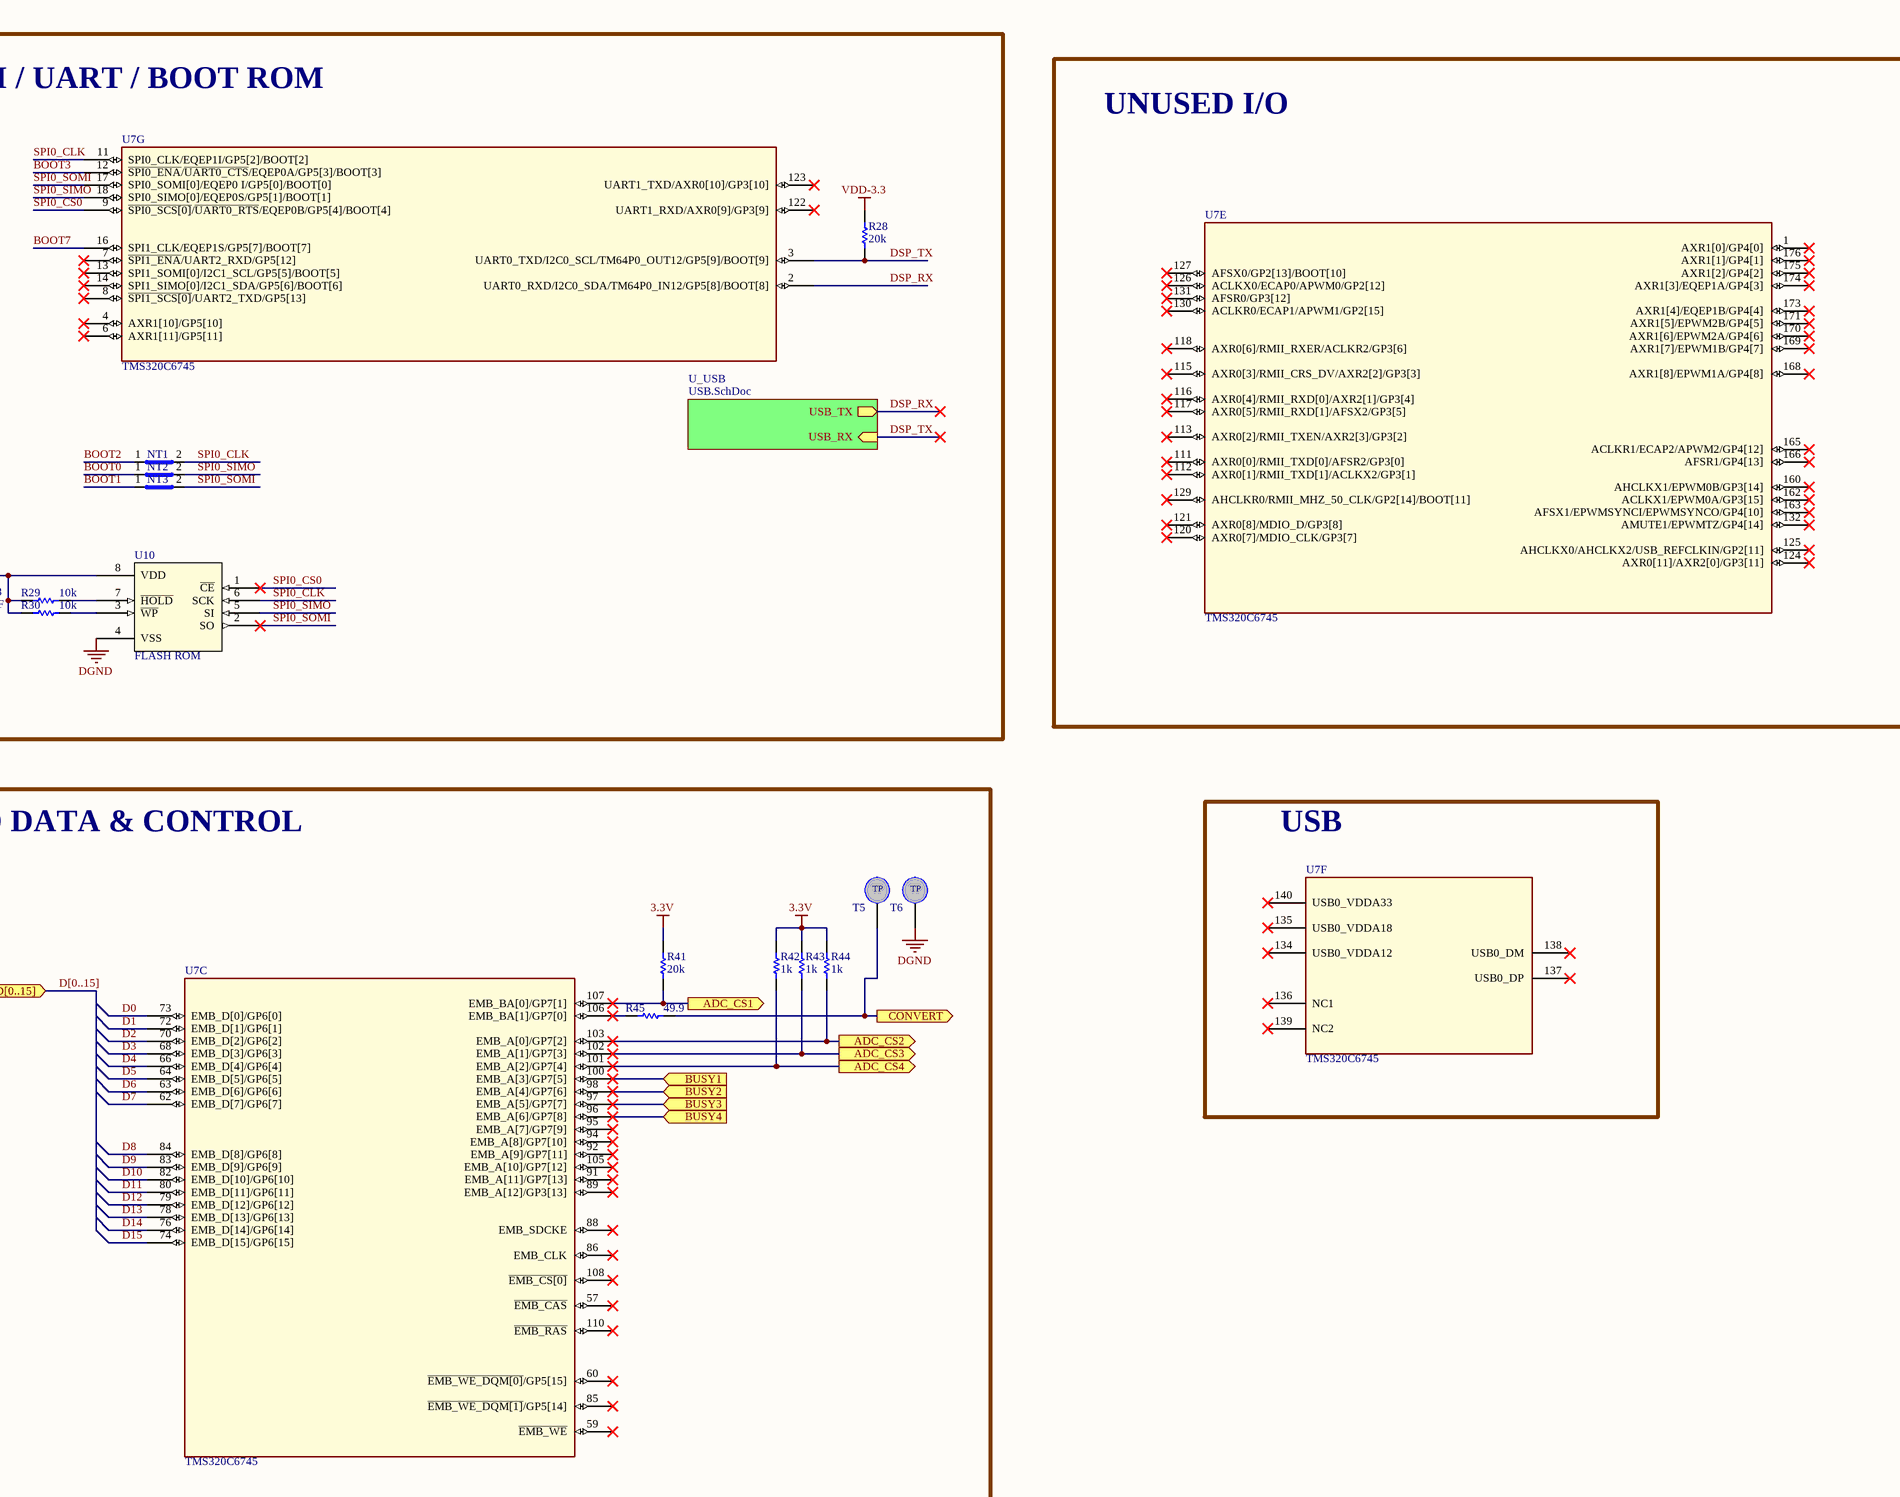
[diagram p4: DSP.SchDoc, top right]
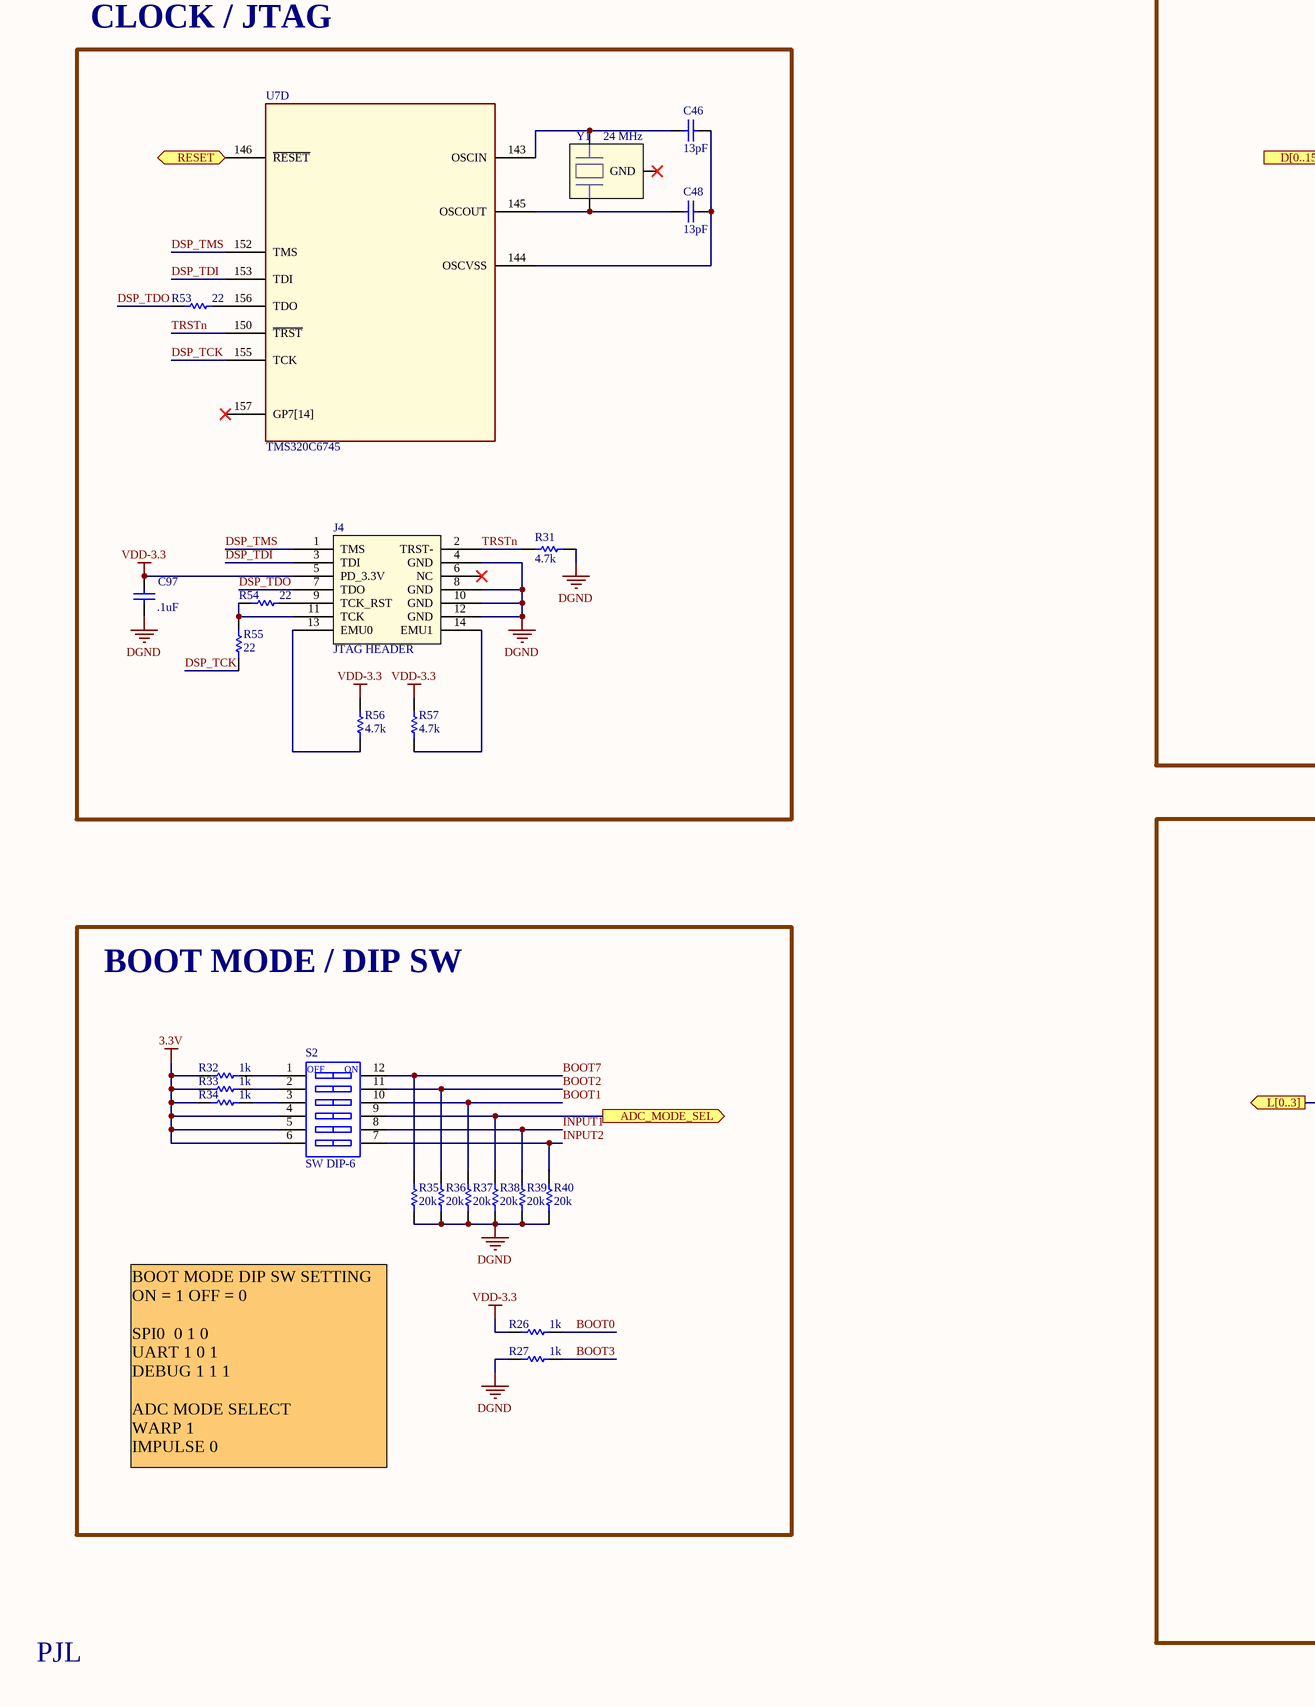
[diagram p5: DSP.SchDoc, bottom left]
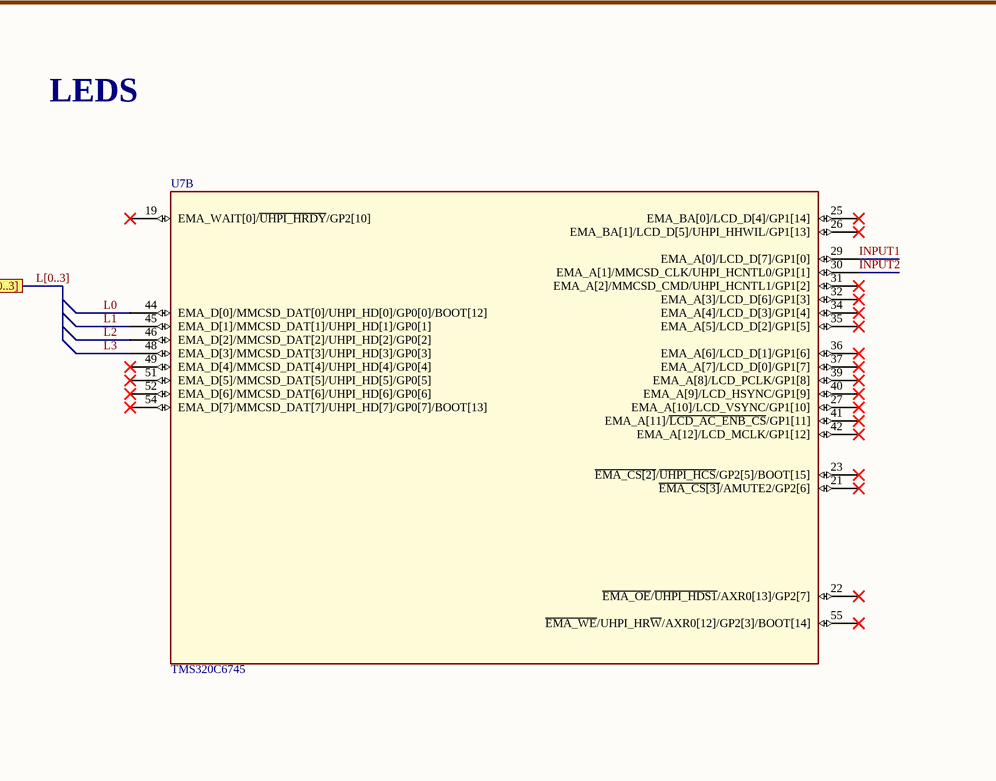
[diagram p6: DSP.SchDoc, bottom right]

### Parts
C46  13pF  [CAPC2012XL]
C48  13pF  [CAPC2012XL]
C52  .1uF  [CAPC1608XN]
C53  .1uF  [CAPC1608XN]
C54  .1uF  [CAPC1608XN]
C55  .1uF  [CAPC1608XN]
C56  .1uF  [CAPC1608XN]
C57  .1uF  [CAPC1608XN]
C58  .1uF  [CAPC1608XN]
C59  .1uF  [CAPC1608XN]
C60  .1uF  [CAPC1608XN]
C61  .1uF  [CAPC1608XN]
C62  .1uF  [CAPC1608XN]
C63  .1uF  [CAPC1608XN]
C64  .1uF  [CAPC1608XN]
C65  .1uF  [CAPC1608XN]
C66  .1uF  [CAPC1608XN]
C67  .1uF  [CAPC1608XN]
C68  .1uF  [CAPC1608XN]
C69  .1uF  [CAPC1608XN]
C70  .1uF  [CAPC1608XN]
C71  .1uF  [CAPC1608XN]
C72  .1uF  [CAPC1608XN]
C73  .1uF  [CAPC1608XN]
C74  .1uF  [CAPC1608XN]
C75  .01uF  [CAPC1608XN]
C76  .1uF  [CAPC1608XN]
C77  .01uF  [CAPC1608XN]
C78  .1uF  [CAPC1608XN]
C79  .1uF  [CAPC1608XN]
C80  .1uF  [CAPC1608XN]
C81  .1uF  [CAPC1608XN]
C82  .1uF  [CAPC1608XN]
C83  .1uF  [CAPC1608XN]
C84  .1uF  [CAPC1608XN]
C85  .1uF  [CAPC1608XN]
C86  .1uF  [CAPC1608XN]
C87  .01uF  [CAPC1608XN]
C88  .1uF  [CAPC1608XN]
C89  .1uF  [CAPC1608XN]
C90  .1uF  [CAPC1608XN]
C91  .1uF  [CAPC1608XN]
C92  .1uF  [CAPC1608XN]
C93  .1uF  [CAPC1608XN]
C94  .1uF  [CAPC1608XN]
C95  .1uF  [CAPC1608XN]
C96  .1uF  [CAPC1608XN]
C97  .1uF  [CAPC1608XN]
C98  .1uF  [CAPC1608XN]
C99  .01uF  [CAPC1608XN]
FB2  FERRITE 50  [RESC3116X06N/1206]  (value not drawn)
FB3  FERRITE 50  [RESC3116X06N/1206]  (value not drawn)
J4  JTAG HEADER  [JTAG HEADER - 14]
NT1  Net Tie SMT  [NetTie 10 mil]  (value not drawn)  (net tie, no BOM)
NT2  Net Tie SMT  [NetTie 10 mil]  (value not drawn)  (net tie, no BOM)
NT3  Net Tie SMT  [NetTie 10 mil]  (value not drawn)  (net tie, no BOM)
R26  1k  [RESC1608XL]
R27  1k  [RESC1608XL]
R28  20k  [RESC1608XL]
R29  10k  [RESC1608XL]
R30  10k  [RESC1608XL]
R31  4.7k  [RESC1608XL]
R32  1k  [RESC1608XL]
R33  1k  [RESC1608XL]
R34  1k  [RESC1608XL]
R35  20k  [RESC1608XL]
R36  20k  [RESC1608XL]
R37  20k  [RESC1608XL]
R38  20k  [RESC1608XL]
R39  20k  [RESC1608XL]
R40  20k  [RESC1608XL]
R41  20k  [RESC1608XL]
R42  1k  [RESC1608XL]
R43  1k  [RESC1608XL]
R44  1k  [RESC1608XL]
R45  49.9  [RESC1608XL]
R53  22  [RESC1608XL]
R54  22  [RESC1608XL]
R55  22  [RESC1608XL]
R56  4.7k  [RESC1608XL]
R57  4.7k  [RESC1608XL]
S2  SW DIP-6  [DIPSW-6]
T5  TEST  [KEYSTONE-TEST-POINT]  (value not drawn)
T6  TEST  [KEYSTONE-TEST-POINT]  (value not drawn)
U7  TMS320C6745  [PQFP-176N - TI]  (parts A,B,C,D,E,F,G of 7)
U10  FLASH ROM  [SOIC-8N]
Y1  24 MHz  [CTS405]

### Blocks framed on the sheet
POWER / DECOUPLING: C52-C87 C89-C96 C98 C99 FB2 FB3 U7
SPI / UART / BOOT ROM: C88 NT1-NT3 R28-R30 U7 U10
UNUSED I/O: U7
ACD DATA & CONTROL: R41-R45 T5 T6 U7
USB: U7
CLOCK / JTAG: C46 C48 C97 J4 R31 R53-R57 U7 Y1
LEDS: U7
BOOT MODE / DIP SW: R26 R27 R32-R40 S2

### Sub-sheets
U_USB = USB.SchDoc: USB_TX (out), USB_RX (in)

### Ports
ADC_CS1 (out), ADC_CS2 (out), ADC_CS3 (out), ADC_CS4 (out), ADC_MODE_SEL (out), BUSY1 (in), BUSY2 (in), BUSY3 (in), BUSY4 (in), CONVERT (out), D[0..15] (in), L[0..3] (out), RESET (in)

### Nets
3.3v: R32.1 R33.1 R34.1 R41.2 R42.2 R43.2 R44.2 S2.4(A4) S2.5(A5) S2.6(A6)
CVDD-1.3: C74.2 C75.2 C78.2 C79.2 C80.2 C81.2 C82.2 C83.2 C84.2 C85.2 C86.2 C87.2 C89.2 C90.2 C91.2 C92.2 C93.2 C94.2 C95.2 C96.2 C98.2 C99.2 FB2.2 U7.10(CVDD1) U7.20(CVDD2) U7.28(CVDD3) U7.38(CVDD4) U7.50(CVDD5) U7.56(CVDD6) U7.61(CVDD7) U7.67(RVDD1) U7.69(CVDD8) U7.77(CVDD9) U7.93(CVDD10) U7.104(CVDD11) U7.114(CVDD12) U7.133(RSV2) U7.147(CVDD13) U7.148(RSV4) U7.149(RSV3) U7.154(CVDD14) U7.159(RVDD2) U7.161(CVDD15) U7.167(CVDD16)
DGND: C52.1 C53.1 C54.1 C55.1 C56.1 C57.1 C58.1 C59.1 C60.1 C61.1 C62.1 C63.1 C64.1 C65.1 C66.1 C67.1 C68.1 C69.1 C70.1 C71.1 C72.1 C73.1 C74.1 C75.1 C78.1 C79.1 C80.1 C81.1 C82.1 C83.1 C84.1 C85.1 C86.1 C87.1 C88.1 C89.1 C90.1 C91.1 C92.1 C93.1 C94.1 C95.1 C96.1 C97.1 C98.1 C99.1 FB3.2 J4.4(GND) J4.8(GND) J4.10(GND) J4.12(GND) R27.2 R31.2 R35.2 R36.2 R37.2 R38.2 R39.2 R40.2 T6.1 U7.177(VSS1) U10.4(VSS)
VDD-3.3: C52.2 C53.2 C54.2 C55.2 C56.2 C57.2 C58.2 C59.2 C60.2 C61.2 C62.2 C63.2 C64.2 C65.2 C66.2 C67.2 C68.2 C69.2 C70.2 C71.2 C72.2 C73.2 C88.2 C97.2 J4.5(PD_3.3V) R26.2 R28.1 R29.2 R30.2 R56.1 R57.1 U7.5(DVDD1) U7.15(DVDD2) U7.24(DVDD3) U7.33(DVDD4) U7.43(DVDD5) U7.47(DVDD6) U7.53(DVDD7) U7.58(DVDD8) U7.65(DVDD9) U7.71(DVDD10) U7.75(DVDD11) U7.81(DVDD12) U7.87(DVDD13) U7.90(DVDD14) U7.99(DVDD15) U7.109(DVDD16) U7.119(DVDD17) U7.128(DVDD18) U7.151(DVDD19) U7.158(DVDD20) U7.164(DVDD21) U7.172(DVDD22) U10.8(VDD)
ADC_CS1: R41.1 U7.107(EMB_BA[0]/GP7[1]) ; port ADC_CS1
ADC_CS2: R44.1 U7.103(EMB_A[0]/GP7[2]) ; port ADC_CS2
ADC_CS3: R43.1 U7.102(EMB_A[1]/GP7[3]) ; port ADC_CS3
ADC_CS4: R42.1 U7.101(EMB_A[2]/GP7[4]) ; port ADC_CS4
BOOT0: NT2.1(Net1) R26.1
BOOT1: NT3.1(Net1) R37.1 S2.10(B3)
BOOT2: NT1.1(Net1) R36.1 S2.11(B2)
BOOT3: R27.1 U7.12(~{SPI0_ENA}/~{UART0_CTS}/EQEP0A/GP5[3]/BOOT[3])
BOOT7: R35.1 S2.12(B1) U7.16(SPI1_CLK/EQEP1S/GP5[7]/BOOT[7])
BUSY1: U7.100(EMB_A[3]/GP7[5]) ; port BUSY1
BUSY2: U7.98(EMB_A[4]/GP7[6]) ; port BUSY2
BUSY3: U7.97(EMB_A[5]/GP7[7]) ; port BUSY3
BUSY4: U7.96(EMB_A[6]/GP7[8]) ; port BUSY4
CONVERT: R45.1 T5.1 ; port CONVERT
D0: U7.73(EMB_D[0]/GP6[0])
D1: U7.72(EMB_D[1]/GP6[1])
D2: U7.70(EMB_D[2]/GP6[2])
D3: U7.68(EMB_D[3]/GP6[3])
D4: U7.66(EMB_D[4]/GP6[4])
D5: U7.64(EMB_D[5]/GP6[5])
D6: U7.63(EMB_D[6]/GP6[6])
D7: U7.62(EMB_D[7]/GP6[7])
D8: U7.84(EMB_D[8]/GP6[8])
D9: U7.83(EMB_D[9]/GP6[9])
D10: U7.82(EMB_D[10]/GP6[10])
D11: U7.80(EMB_D[11]/GP6[11])
D12: U7.79(EMB_D[12]/GP6[12])
D13: U7.78(EMB_D[13]/GP6[13])
D14: U7.76(EMB_D[14]/GP6[14])
D15: U7.74(EMB_D[15]/GP6[15])
DSP_RX: U7.2(UART0_RXD/I2C0_SDA/TM64P0_IN12/GP5[8]/BOOT[8]) ; sheet U_USB/USB_TX
DSP_TCK: R55.1 U7.155(TCK)
DSP_TDI: J4.3(TDI) U7.153(TDI)
DSP_TDO: J4.7(TDO) R53.2
DSP_TMS: J4.1(TMS) U7.152(TMS)
DSP_TX: R28.2 U7.3(UART0_TXD/I2C0_SCL/TM64P0_OUT12/GP5[9]/BOOT[9]) ; sheet U_USB/USB_RX
INPUT1: R39.1 S2.8(B5) U7.29(EMA_A[0]/LCD_D[7]/GP1[0])
INPUT2: R40.1 S2.7(B6) U7.30(EMA_A[1]/MMCSD_CLK/UHPI_HCNTL0/GP1[1])
L0: U7.44(EMA_D[0]/MMCSD_DAT[0]/UHPI_HD[0]/GP0[0]/BOOT[12])
L1: U7.45(EMA_D[1]/MMCSD_DAT[1]/UHPI_HD[1]/GP0[1])
L2: U7.46(EMA_D[2]/MMCSD_DAT[2]/UHPI_HD[2]/GP0[2])
L3: U7.48(EMA_D[3]/MMCSD_DAT[3]/UHPI_HD[3]/GP0[3])
MODE: R38.1 S2.9(B4) ; port ADC_MODE_SEL
SPI0_CLK: NT1.2(Net2) U7.11(SPI0_CLK/EQEP1I/GP5[2]/BOOT[2]) U10.6(SCK)
SPI0_CS0: U7.9(~{SPI0_SCS[0]}/~{UART0_RTS}/EQEP0B/GP5[4]/BOOT[4]) U10.1(~{CE})
SPI0_SIMO: NT2.2(Net2) U7.18(SPI0_SIMO[0]/EQEP0S/GP5[1]/BOOT[1]) U10.5(SI)
SPI0_SOMI: NT3.2(Net2) U7.17(SPI0_SOMI[0]/EQEP0_I/GP5[0]/BOOT[0]) U10.2(SO)
TRSTn: J4.2(TRST-) R31.1 U7.150(~{TRST})
NetC46_1: C46.1 C48.1 U7.144(OSCVSS)
NetC46_2: C46.2 U7.143(OSCIN) Y1.1
NetC48_2: C48.2 U7.145(OSCOUT) Y1.3
NetC76_1: C76.1 C77.1 FB3.1 U7.142(PLL0_VSSA)
NetC76_2: C76.2 C77.2 FB2.1 U7.141(PLL0_VDDA)
NetJ4_9: J4.9(TCK_RST) R54.2
NetJ4_11: J4.11(TCK) R54.1 R55.2
NetJ4_13: J4.13(EMU0) R56.2
NetJ4_14: J4.14(EMU1) R57.2
NetNC1_1: U7.146(~{RESET}) ; port RESET
NetR29_1: R29.1 U10.7(~{HOLD})
NetR30_1: R30.1 U10.3(~{WP})
NetR32_2: R32.2 S2.1(A1)
NetR33_2: R33.2 S2.2(A2)
NetR34_2: R34.2 S2.3(A3)
NetR45_2: R45.2 U7.106(EMB_BA[1]/GP7[0])
NetR53_1: R53.1 U7.156(TDO)

Not connected (* = marked no-connect by the designer): J4 6(NC)*; U7 1(AXR1[0]/GP4[0])* 4(AXR1[10]/GP5[10])* 6(AXR1[11]/GP5[11])* 7(~{SPI1_ENA}/UART2_RXD/GP5[12])* 8(~{SPI1_SCS[0]}/UART2_TXD/GP5[13])* 13(SPI1_SOMI[0]/I2C1_SCL/GP5[5]/BOOT[5])* 14(SPI1_SIMO[0]/I2C1_SDA/GP5[6]/BOOT[6])* 19(EMA_WAIT[0]/~{UHPI_HRDY}/GP2[10])* 21(~{EMA_CS[3]}/AMUTE2/GP2[6])* 22(~{EMA_OE}/~{UHPI_HDS1}/AXR0[13]/GP2[7])* 23(~{EMA_CS[2]}/~{UHPI_HCS}/GP2[5]/BOOT[15])* 25(EMA_BA[0]/LCD_D[4]/GP1[14])* 26(EMA_BA[1]/LCD_D[5]/UHPI_HHWIL/GP1[13])* 27(EMA_A[10]/LCD_VSYNC/GP1[10])* 31(EMA_A[2]/MMCSD_CMD/UHPI_HCNTL1/GP1[2])* 32(EMA_A[3]/LCD_D[6]/GP1[3])* 34(EMA_A[4]/LCD_D[3]/GP1[4])* 35(EMA_A[5]/LCD_D[2]/GP1[5])* 36(EMA_A[6]/LCD_D[1]/GP1[6])* 37(EMA_A[7]/LCD_D[0]/GP1[7])* 39(EMA_A[8]/LCD_PCLK/GP1[8])* 40(EMA_A[9]/LCD_HSYNC/GP1[9])* 41(EMA_A[11]/~{LCD_AC_ENB_CS}/GP1[11])* 42(EMA_A[12]/LCD_MCLK/GP1[12])* 49(EMA_D[4]/MMCSD_DAT[4]/UHPI_HD[4]/GP0[4])* 51(EMA_D[5]/MMCSD_DAT[5]/UHPI_HD[5]/GP0[5])* 52(EMA_D[6]/MMCSD_DAT[6]/UHPI_HD[6]/GP0[6])* 54(EMA_D[7]/MMCSD_DAT[7]/UHPI_HD[7]/GP0[7]/BOOT[13])* 55(~{EMA_WE}/UHPI_HR~{W}/AXR0[12]/GP2[3]/BOOT[14])* 57(~{EMB_CAS})* 59(~{EMB_WE})* 60(~{EMB_WE_DQM[0]}/GP5[15])* 85(~{EMB_WE_DQM[1]}/GP5[14])* 86(EMB_CLK)* 88(EMB_SDCKE)* 89(EMB_A[12]/GP3[13])* 91(EMB_A[11]/GP7[13])* 92(EMB_A[9]/GP7[11])* 94(EMB_A[8]/GP7[10])* 95(EMB_A[7]/GP7[9])* 105(EMB_A[10]/GP7[12])* 108(~{EMB_CS[0]})* 110(~{EMB_RAS})* 111(AXR0[0]/RMII_TXD[0]/AFSR2/GP3[0])* 112(AXR0[1]/RMII_TXD[1]/ACLKX2/GP3[1])* 113(AXR0[2]/RMII_TXEN/AXR2[3]/GP3[2])* 115(AXR0[3]/RMII_CRS_DV/AXR2[2]/GP3[3])* 116(AXR0[4]/RMII_RXD[0]/AXR2[1]/GP3[4])* 117(AXR0[5]/RMII_RXD[1]/AFSX2/GP3[5])* 118(AXR0[6]/RMII_RXER/ACLKR2/GP3[6])* 120(AXR0[7]/MDIO_CLK/GP3[7])* 121(AXR0[8]/MDIO_D/GP3[8])* 122(UART1_RXD/AXR0[9]/GP3[9])* 123(UART1_TXD/AXR0[10]/GP3[10])* 124(AXR0[11]/AXR2[0]/GP3[11])* 125(AHCLKX0/AHCLKX2/USB_REFCLKIN/GP2[11])* 126(ACLKX0/ECAP0/APWM0/GP2[12])* 127(AFSX0/GP2[13]/BOOT[10])* 129(AHCLKR0/RMII_MHZ_50_CLK/GP2[14]/BOOT[11])* 130(ACLKR0/ECAP1/APWM1/GP2[15])* 131(AFSR0/GP3[12])* 132(AMUTE1/EPWMTZ/GP4[14])* 134(USB0_VDDA12)* 135(USB0_VDDA18)* 136(NC1)* 137(USB0_DP)* 138(USB0_DM)* 139(NC2)* 140(USB0_VDDA33)* 157(GP7[14])* 160(AHCLKX1/EPWM0B/GP3[14])* 162(ACLKX1/EPWM0A/GP3[15])* 163(AFSX1/EPWMSYNCI/EPWMSYNCO/GP4[10])* 165(ACLKR1/ECAP2/APWM2/GP4[12])* 166(AFSR1/GP4[13])* 168(AXR1[8]/EPWM1A/GP4[8])* 169(AXR1[7]/EPWM1B/GP4[7])* 170(AXR1[6]/EPWM2A/GP4[6])* 171(AXR1[5]/EPWM2B/GP4[5])* 173(AXR1[4]/EQEP1B/GP4[4])* 174(AXR1[3]/EQEP1A/GP4[3])* 175(AXR1[2]/GP4[2])* 176(AXR1[1]/GP4[1])*; Y1 2,4(GND)*

### Buses and harness runs
bus D[0..15] = port D[0..15]
bus L[0..3] = port L[0..3]

### Notes on the sheet
- BOOT MODE DIP SW SETTING
  ON = 1	OFF = 0
  SPI0 	0 1 0
  UART	1 0 1
  DEBUG	1 1 1
  ADC MODE SELECT
  WARP	1
  IMPULSE	0
- PJL
- (in symbol SW DIP-6) OFF; ON
- (in symbol TEST-POINT) TP

### Library data of the parts
C46 C48 = CAP-CERAMIC-NP: CAP CER 10UF 10V 10% X7R 0805; Manufacturer: Murata Electronics North America; Manufacturer Part Number: GRM1885C1H130JA01D; Tolerance: ±5%; Description: CAP CER 13PF 50V 5% NP0 0603; Voltage - Rated: 50V; Temperature Coefficient: C0G, NP0; Operating Temperature: -55°C ~ 125°C; Capacitance: 13pF; Supplier Part Number: 490-1406-1-ND; Supplier: Digi-Key; Package / Case: 0603 (1608 Metric)
C52-C74 C76 C78-C86 C88-C98 = CAP-CERAMIC-NP: as C29 on sheet POWER; Applications: Bypass, Decoupling; Operating Temperature: -55°C ~ 125°C; Tolerance: ±20%; Package / Case: 0603 (1608 Metric); Voltage - Rated: 10V; Temperature Coefficient: X7R; Supplier Part Number: 311-1237-1-ND; Supplier: Digi-Key
C75 C77 C87 C99 = Capacitor: CAP CER 10000PF 16V 10% X7R 0603; Manufacturer Part Number: GRM188R71C103KA01D; Manufacturer: Murata Electronics North America; Package / Case: 0603 (1608 Metric); Voltage - Rated: 16V; Capacitance: 10000pF; Temperature Coefficient: X7R; Tolerance: ±10%; Supplier: Digi-Key; Supplier Part Number: 490-1525-1-ND
FB2 FB3 = FERRITE: FERRITE BEAD 60 OHM 3.0A 0805; Manufacturer: Murata Electronics North America; Manufacturer Part Number: BLM31PG500SN1L; Description: FERRITE CHIP 50 OHM 3000MA 1206; Filter Type: Differential Mode - Single; Impedance @ Frequency: 50 Ohm @ 100MHz; Current Rating: 3A; Supplier: Digi-Key; Supplier Part Number: 490-1055-1-ND; Package / Case: 1206 (3216 Metric)
J4 = JTAG-TI_14: 14 Pin JTAG Header
NT1-NT3 = NetTie: Net-Tie, Surface Mount
R26 R27 R32-R34 R42-R44 = RES-CHIP: Resistor Chip; Manufacturer: Yageo; Manufacturer Part Number: RC0603JR-071KL; Description: RES 1.0K OHM 1/10W 5% 0603 SMD; Tolerance: ±5%; Power (Watts): 0.1W, 1/10W; Supplier Part Number: 311-1.0KGRCT-ND; Supplier: Digi-Key; Package / Case: 0603 (1608 Metric); Resistance (Ohms): 1k
R28 R35-R41 = RES-CHIP: Resistor Chip; Manufacturer Part Number: RC0603JR-0720KL; Manufacturer: Yageo; Tolerance: ±5%; Power (Watts): 0.1W, 1/10W; Description: RES 20K OHM 1/10W 5% 0603 SMD; Package / Case: 0603 (1608 Metric); Supplier: Digi-Key; Supplier Part Number: 311-20KGRCT-ND; Resistance (Ohms): 20k
R29 R30 = RES-CHIP: as R25 on sheet POWER; Supplier Part Number: 311-10KGRCT-ND; Supplier: Digi-Key; Package / Case: 0603 (1608 Metric); Resistance (Ohms): 10k
R31 R56 R57 = RES-CHIP: Resistor Chip; Manufacturer: Yageo; Manufacturer Part Number: RC0603JR-074K7L; Tolerance: ±5%; Power (Watts): 0.1W, 1/10W; Description: RES 4.7K OHM 1/10W 5% 0603 SMD; Resistance (Ohms): 4.7k; Package / Case: 0603 (1608 Metric); Supplier: Digi-Key; Supplier Part Number: 311-4.7KGRDKR-ND
R45 = RES-CHIP: Resistor Chip; Manufacturer: Yageo; Manufacturer Part Number: RC0603FR-0749R9L; Power (Watts): 0.1W, 1/10W; Description: RES 49.9 OHM 1/10W 1% 0603 SMD; Tolerance: ±1%; Supplier: Digi-Key; Package / Case: 0603 (1608 Metric); Supplier Part Number: 311-49.9HRCT-ND; Resistance (Ohms): 49.9
R53-R55 = RES-CHIP: Resistor Chip; Manufacturer Part Number: RC0603FR-0722RL; Manufacturer: Yageo; Tolerance: ±1%; Power (Watts): 0.1W, 1/10W; Description: RES 22.0 OHM 1/10W 1% 0603 SMD; Package / Case: 0603 (1608 Metric); Supplier Part Number: 311-22.0HRCT-ND; Resistance (Ohms): 22; Supplier: Digi-Key
S2 = SW DIP-6: SWITCH DIP 6POS HALF PITCH SMD; Manufacturer: C&K Components; Manufacturer Part Number: TDA06H0SB1R; Contact Rating @ Voltage: 0.025A @ 24VDC; Number of Positions: 6; Circuit: SPST; Actuator Level: Flush; Supplier: Digi-Key; Supplier Part Number: CKN9503CT-ND
T5 T6 = TEST-POINT: as T2 on sheet Analog; Mounting Type: 0.063" (1.60mm) Hole Diameter; Supplier: Digi-Key; Supplier Part Number: 5006K-ND
U7 = TMS320C6745: IC DSP FIX/FLOAT POINT 176HLQFP; Manufacturer Part Number: TMS320C6745CPTP4; Manufacturer: Texas Instruments; Voltage - Core: 1.20V; On-Chip RAM: 320kB; Voltage - I/O: 3.30V; Clock Rate: 456MHz; SlotXofY: SYM 7 OF 7; Supplier: Digi-Key; Type: Fixed/Floating Point; Package / Case: 176-LQFP Exposed Pad; SymName: TMS320C6745; Supplier Part Number: 296-30152-5-ND
U10 = Memory - SPI 32M Flash: IC FLASH SER 32M 80MHZ SPI 8SOIC; Manufacturer Part Number: SST25VF032B-80-4I-S2AF; Manufacturer: Microchip Technology; Voltage - Supply: 2.7 V ~ 3.6 V; Memory Size: 32M (4M x 8); Interface: SPI Serial; Memory Type: FLASH; Supplier: Digi-Key; Package / Case: 8-SOIC (0.209", 5.30mm Width); Supplier Part Number: SST25VF032B-80-4I-S2AF-ND
Y1 = CTS405 25MHz Crystal: CRYSTAL 24.0 MHZ 13PF SMD; Manufacturer Part Number: 405C35B24M00000; Manufacturer: CTS-Frequency Controls; Description: CRYSTAL 24.000000 MHZ 13PF SMD; ESR (Equivalent Series Resistance): 50 Ohm; Frequency: 24MHz; Supplier: Digi-Key; Load Capacitance: 13pF; Supplier Part Number: CTX651CT-ND

## Sheet USB.SchDoc
size A
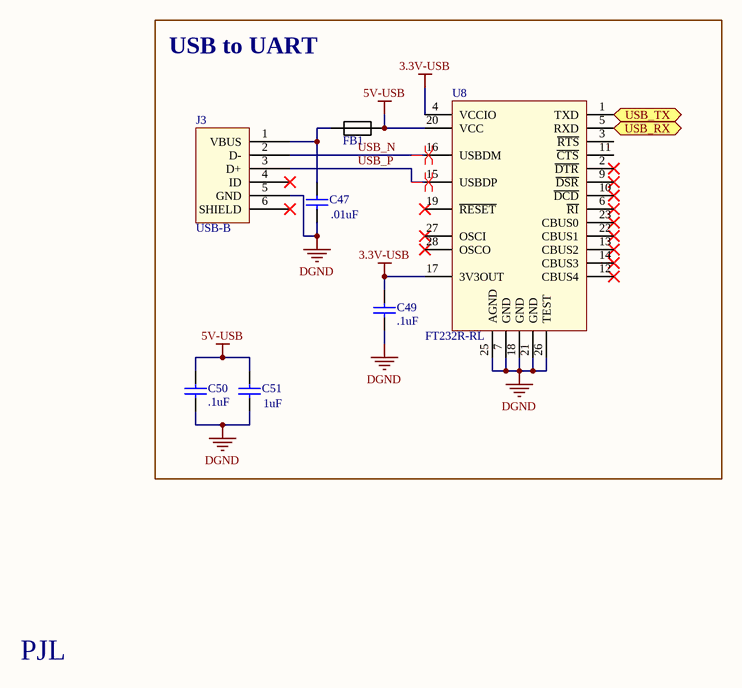
[diagram p7: USB.SchDoc]

### Parts
C47  .01uF  [CAPC1608XL]
C49  .1uF  [CAPC1608XN]
C50  .1uF  [CAPC1608XN]
C51  1uF  [CAPC1608XN]
FB1  FERRITE  [RESC2012X06N/0805]  (value not drawn)
J3  USB-B  [USB-MiniB-90]
U8  FT232R-RL  [SOP65P780X200-28L]

### Blocks framed on the sheet
USB to UART: C47 C49-C51 FB1 J3 U8

### Ports
USB_RX (in), USB_TX (out)

### Nets
3.3V-USB: C49.2 U8.4(VCCIO) U8.17(3V3OUT)
5V-USB: C50.2 C51.2 FB1.2 U8.20(VCC)
DGND: C47.1 C49.1 C50.1 C51.1 J3.5(GND) U8.7(GND) U8.18(GND) U8.21(GND) U8.25(AGND) U8.26(TEST)
DSP_RX: U8.1(TXD) ; port USB_TX
DSP_TX: U8.5(RXD) ; port USB_RX
USB_N: J3.2(D-) U8.16(USBDM)
USB_P: J3.3(D+) U8.15(USBDP)
NetC47_2: C47.2 FB1.1 J3.1(VBUS)

Not connected (* = marked no-connect by the designer): J3 4(ID)* 6(SHIELD)*; U8 2(~{DTR})* 3(~{RTS}) 6(~{RI})* 9(~{DSR})* 10(~{DCD})* 11(~{CTS}) 12(CBUS4)* 13(CBUS2)* 14(CBUS3)* 19(~{RESET})* 22(CBUS1)* 23(CBUS0)* 27(OSCI)* 28(OSCO)*

### Layout directives
differential pair: USB_N, USB_P

### Notes on the sheet
- PJL

### Library data of the parts
C47 = Capacitor: as C75 on sheet DSP; Package / Case: 0603 (1608 Metric); Voltage - Rated: 16V; Capacitance: 10000pF; Temperature Coefficient: X7R; Tolerance: ±10%; Supplier: Digi-Key; Supplier Part Number: 490-1525-1-ND
C49 C50 = CAP-CERAMIC-NP: as C29 on sheet POWER; Applications: Bypass, Decoupling; Operating Temperature: -55°C ~ 125°C; Tolerance: ±20%; Package / Case: 0603 (1608 Metric); Voltage - Rated: 10V; Temperature Coefficient: X7R; Supplier Part Number: 311-1237-1-ND; Supplier: Digi-Key
C51 = Capacitor: CAP CER 1UF 10V 10% X7R 0603; Manufacturer Part Number: GRM188R71A105KA61D; Manufacturer: Murata Electronics North America; Capacitance: 1.0µF; Tolerance: ±10%; Supplier: Digi-Key; Temperature Coefficient: X7R; Package / Case: 0603 (1608 Metric); Voltage - Rated: 10V; Supplier Part Number: 490-3899-1-ND
FB1 = FERRITE: FERRITE BEAD 60 OHM 3.0A 0805; Manufacturer: Wurth Electronics Inc; Manufacturer Part Number: 742792063; Current Rating: 3A; Package / Case: 0805 (2012 Metric); Supplier Part Number: 732-1612-1-ND; Supplier: Digi-Key
J3 = USB-B: CONN MINI USB RCPT RA TYPE B SMD; Manufacturer: TE Connectivity; Manufacturer Part Number: 1734035-2; Mounting Type: Surface Mount, Right Angle, Horizontal; Supplier: Digi-Key; Supplier Part Number: A31727CT-ND
U8 = FT232R-RL: IC USB FS SERIAL UART 28-SSOP; Manufacturer: FTDI, Future Technology Devices International Ltd; Manufacturer Part Number: FT232RL-REEL; Protocol: RS232, RS422, RS485; Voltage - Supply: 3.3 V ~ 5.25 V; Package / Case: 28-SSOP (0.209", 5.30mm Width); Supplier Part Number: 768-1007-1-ND; Supplier: Digi-Key

## Nets that join several sheets
3.3v: Hydrophone2012 (L1.2 L2.2 L3.2 L4.2), POWER (C43.1 C45.2 R19.2 U9.3), A1 (6 pins), A2 (6 pins), A3 (6 pins), A4 (6 pins), DSP (10 pins)
CVDD-1.3: POWER (7 pins), DSP (44 pins)
DGND: Hydrophone2012 (8 pins), POWER (36 pins), A1 (14 pins), A2 (14 pins), A3 (14 pins), A4 (14 pins), DSP (62 pins), USB (10 pins)
V7.2: POWER (7 pins), A1 (9 pins), A2 (9 pins), A3 (9 pins), A4 (9 pins)
VADC: POWER (C28.2 C29.2 Rg2.5), A1 (7 pins), A2 (7 pins), A3 (7 pins), A4 (7 pins)
VDD-3.3: POWER (6 pins), DSP (54 pins)
ADC_CS1: A1 (A_A1.31 A_A1.32), DSP (R41.1 U7.107)
ADC_CS2: A2 (A_A2.31 A_A2.32), DSP (R44.1 U7.103)
ADC_CS3: A3 (A_A3.31 A_A3.32), DSP (R43.1 U7.102)
ADC_CS4: A4 (A_A4.31 A_A4.32), DSP (R42.1 U7.101)
BUSY1: A1 (A_A1.29), DSP (U7.100)
BUSY2: A2 (A_A2.29), DSP (U7.98)
BUSY3: A3 (A_A3.29), DSP (U7.97)
BUSY4: A4 (A_A4.29), DSP (U7.96)
CONVERT: A1 (A_A1.35), A2 (A_A2.35), A3 (A_A3.35), A4 (A_A4.35), DSP (R45.1 T5.1)
D0: A2 (A_A2.9), A3 (A_A3.9), A4 (A_A4.9), DSP (U7.73)
D1: A2 (A_A2.10), A3 (A_A3.10), A4 (A_A4.10), DSP (U7.72)
D2: A2 (A_A2.11), A3 (A_A3.11), A4 (A_A4.11), DSP (U7.70)
D3: A2 (A_A2.12), A3 (A_A3.12), A4 (A_A4.12), DSP (U7.68)
D4: A2 (A_A2.13), A3 (A_A3.13), A4 (A_A4.13), DSP (U7.66)
D5: A2 (A_A2.14), A3 (A_A3.14), A4 (A_A4.14), DSP (U7.64)
D6: A2 (A_A2.15), A3 (A_A3.15), A4 (A_A4.15), DSP (U7.63)
D7: A2 (A_A2.16), A3 (A_A3.16), A4 (A_A4.16), DSP (U7.62)
D8: A2 (A_A2.21), A3 (A_A3.21), A4 (A_A4.21), DSP (U7.84)
D9: A2 (A_A2.22), A3 (A_A3.22), A4 (A_A4.22), DSP (U7.83)
D10: A2 (A_A2.23), A3 (A_A3.23), A4 (A_A4.23), DSP (U7.82)
D11: A2 (A_A2.24), A3 (A_A3.24), A4 (A_A4.24), DSP (U7.80)
D12: A2 (A_A2.25), A3 (A_A3.25), A4 (A_A4.25), DSP (U7.79)
D13: A2 (A_A2.26), A3 (A_A3.26), A4 (A_A4.26), DSP (U7.78)
D14: A2 (A_A2.27), A3 (A_A3.27), A4 (A_A4.27), DSP (U7.76)
D15: A2 (A_A2.28), A3 (A_A3.28), A4 (A_A4.28), DSP (U7.74)
DSP_RX: DSP (U7.2), USB (U8.1)
DSP_TX: DSP (R28.2 U7.3), USB (U8.5)
L0: Hydrophone2012 (R14.1 R49.1), DSP (U7.44)
L1: Hydrophone2012 (R46.1 R50.1), DSP (U7.45)
L2: Hydrophone2012 (R47.1 R51.1), DSP (U7.46)
L3: Hydrophone2012 (R48.1 R52.1), DSP (U7.48)
MODE: A1 (A_A1.6), A2 (A_A2.6), A3 (A_A3.6), A4 (A_A4.6), DSP (R38.1 S2.9)
NetNC1_1: POWER (NC1.1 P1.20 R19.1), DSP (U7.146)